# Altium project PROC114E3_SCH.PrjPcb (part 1 of 22)
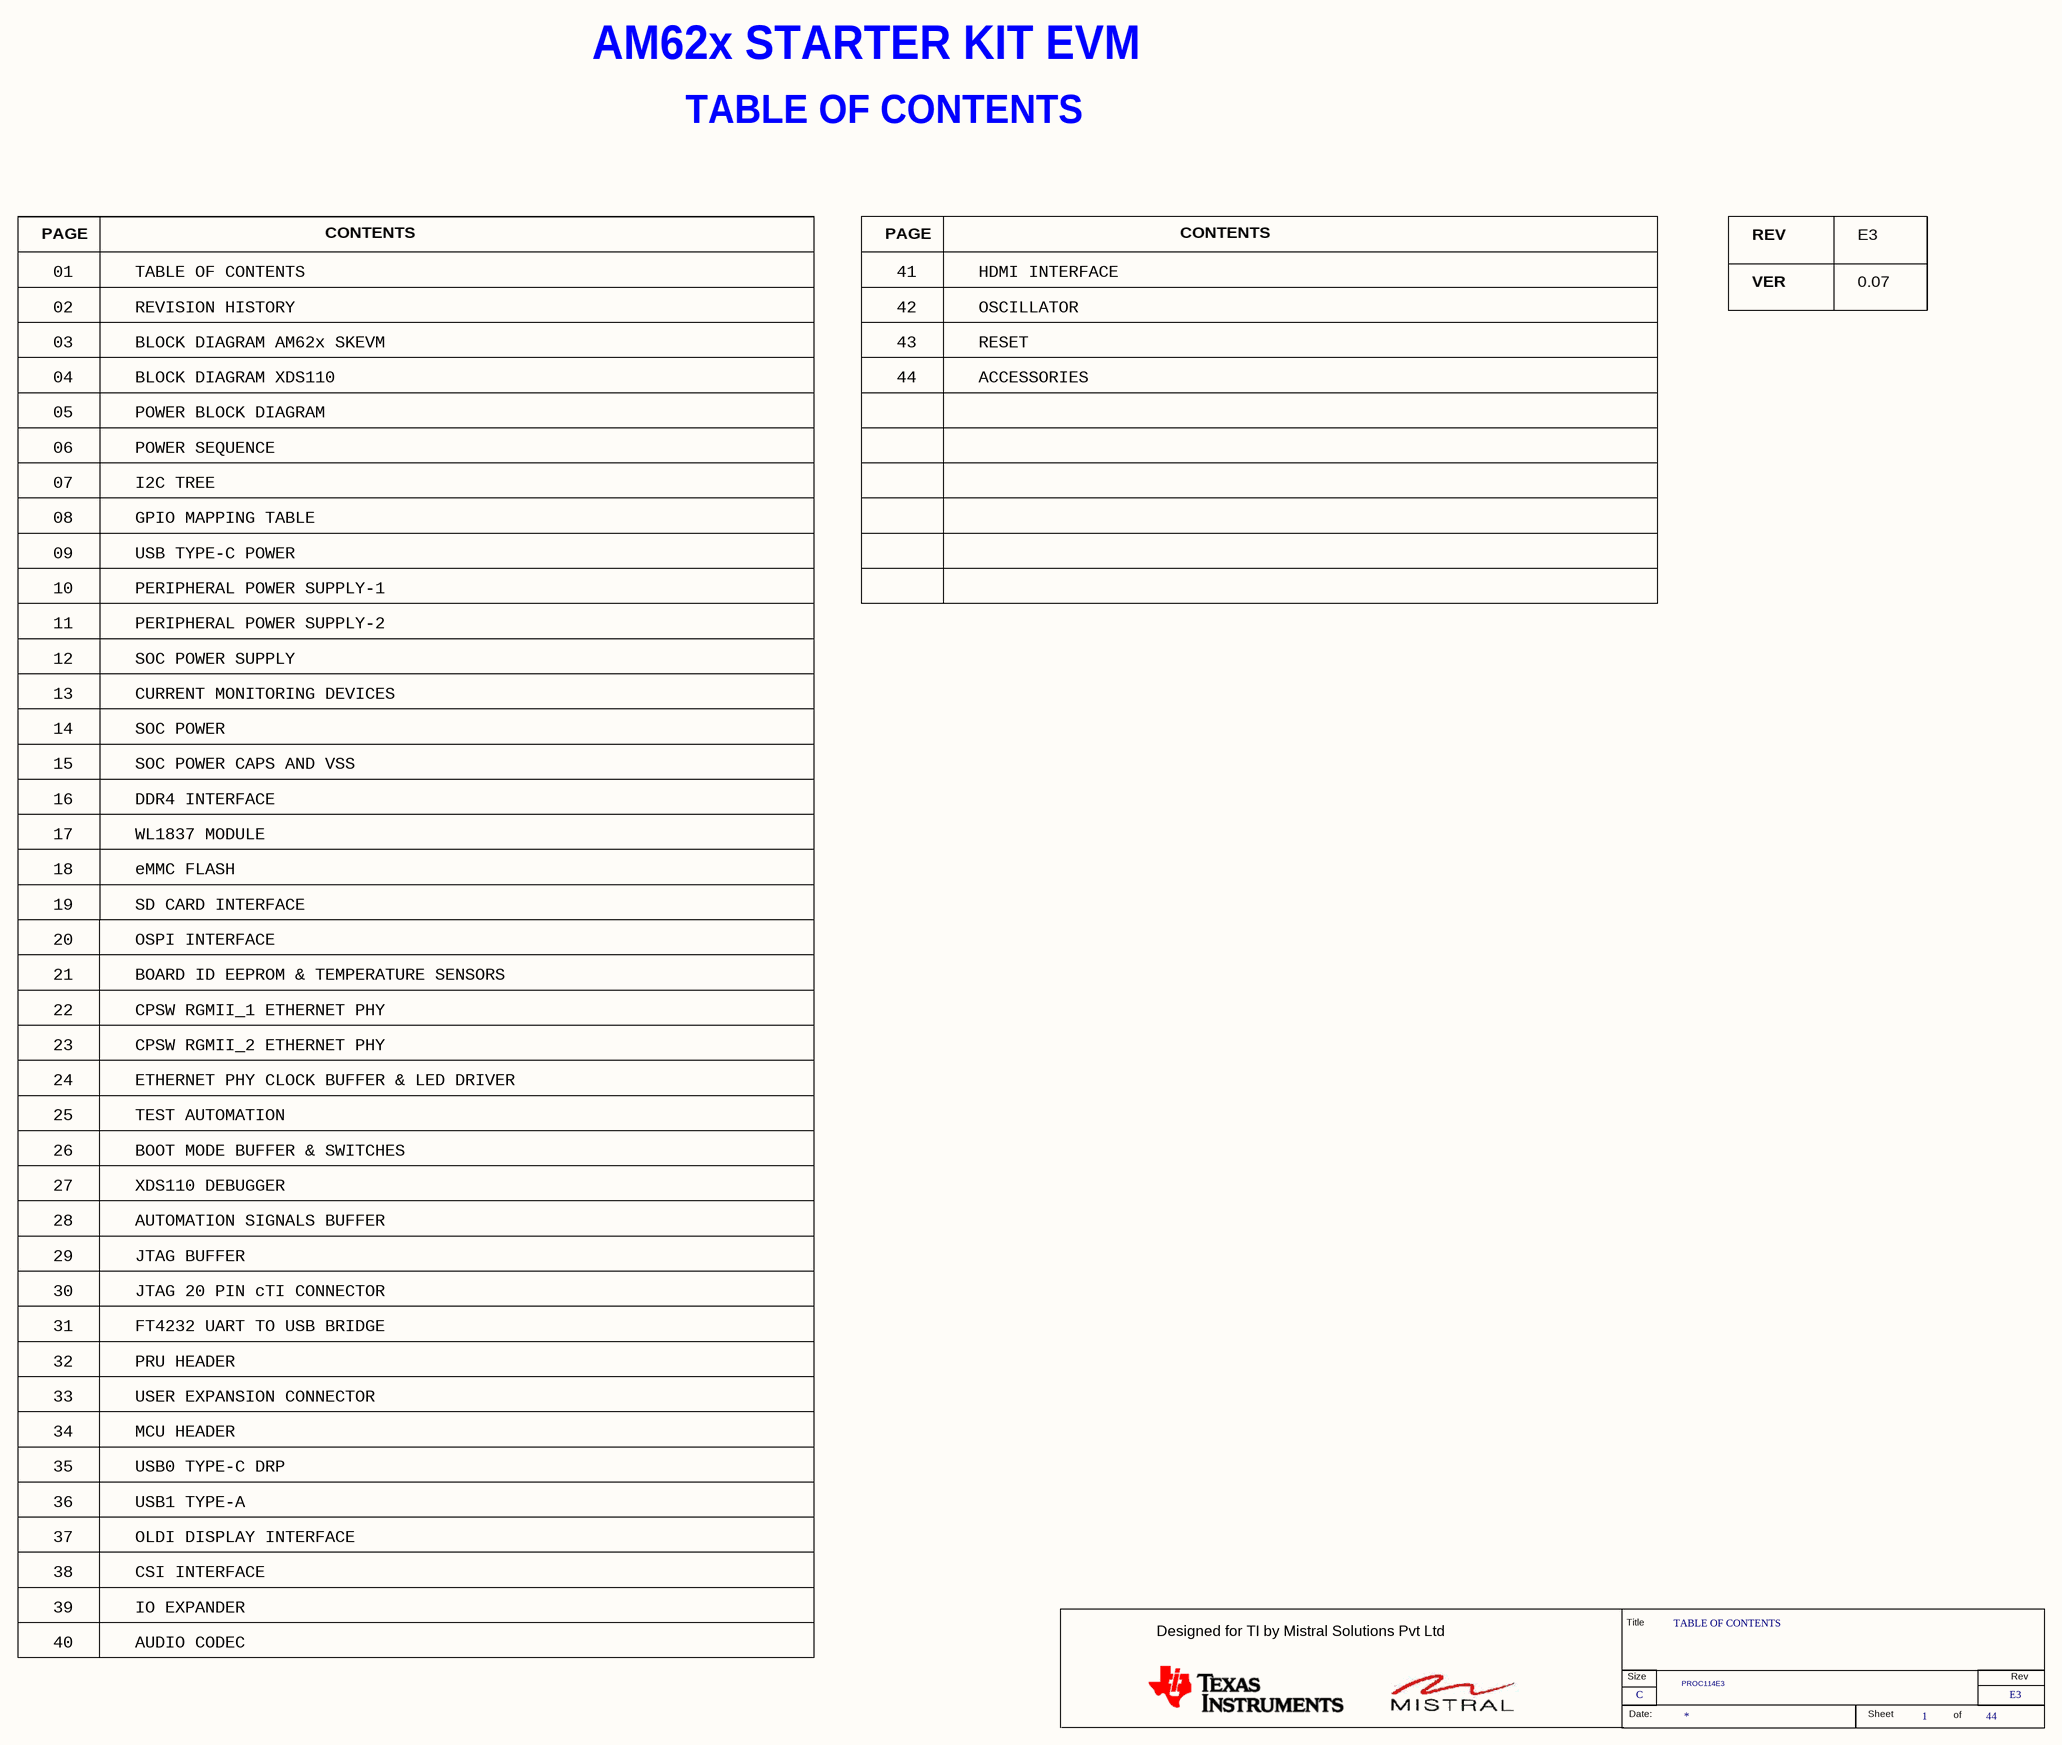
[diagram p0: 01.SchDoc]
44 sheets, 1446 parts. Net scope: global (net labels, ports and power ports of the same name join across sheets).
Board file: PROC114E3_BRD.PcbDoc
Sheets:
  01.SchDoc
  02.SchDoc
  03.SchDoc
  04.SchDoc
  05.SchDoc
  06.SchDoc
  07.SchDoc
  08.SchDoc
  09.SchDoc
  10.SchDoc
  11.SchDoc
  12.SchDoc
  13.SchDoc
  14.SchDoc
  15.SchDoc
  16.SchDoc
  17.SchDoc
  18.SchDoc
  19.SchDoc
  20.SchDoc
  21.SchDoc
  22.SchDoc
  23.SchDoc
  24.SchDoc
  25.SchDoc
  26.SchDoc
  27.SchDoc
  28.SchDoc
  29.SchDoc
  30.SchDoc
  31.SchDoc
  32.SchDoc
  33.SchDoc
  34.SchDoc
  35.SchDoc
  36.SchDoc
  37.SchDoc
  38.SchDoc
  39.SchDoc
  40.SchDoc
  41.SchDoc
  42.SchDoc
  43.SchDoc
  44.SchDoc

## Sheet 01.SchDoc
size 513 x 386 mm

### Parts
(Parts that share a designator on the sheet are numbered #1, #2 ... from top to bottom, then left to right.)
*#1  RevCode: E3  Title: TABLE OF CONTENTS  Page Size: C  Page Number: 1  Page Count: 44  Variant Name: PROC114E3  (hidden comment: MISTRAL_TITLEBLK_CSIZE)  (graphical)

### Notes on the sheet
- AM62x STARTER KIT EVM
- TABLE OF CONTENTS
- PAGE
- CONTENTS
- REV
- E3
- 01
- 41
- HDMI INTERFACE
- VER
- 0.07
- 02
- 03
- REVISION HISTORY
- BLOCK DIAGRAM AM62x SKEVM
- 42
- 43
- OSCILLATOR
- RESET
- 04
- BLOCK DIAGRAM XDS110
- 44
- ACCESSORIES
- 06
- 05
- POWER BLOCK DIAGRAM
- POWER SEQUENCE
- 07
- 08
- GPIO MAPPING TABLE
- I2C TREE
- 09
- USB TYPE-C POWER
- 11
- 10
- PERIPHERAL POWER SUPPLY-1
- PERIPHERAL POWER SUPPLY-2
- 12
- 13
- SOC POWER SUPPLY
- CURRENT MONITORING DEVICES
- 14
- SOC POWER
- 15
- 16
- SOC POWER CAPS AND VSS
- DDR4 INTERFACE
- 17
- 18
- eMMC FLASH
- WL1837 MODULE
- 19
- SD CARD INTERFACE
- 20
- 21
- OSPI INTERFACE
- BOARD ID EEPROM & TEMPERATURE SENSORS
- 22
- 23
- CPSW RGMII_1 ETHERNET PHY
- CPSW RGMII_2 ETHERNET PHY
- 24
- ETHERNET PHY CLOCK BUFFER & LED DRIVER
- 25
- 26
- BOOT MODE BUFFER & SWITCHES
- TEST AUTOMATION
- 27
- 28
- XDS110 DEBUGGER
- AUTOMATION SIGNALS BUFFER
- 29
- JTAG BUFFER
- 30
- 31
- JTAG 20 PIN cTI CONNECTOR
- FT4232 UART TO USB BRIDGE
- 32
- 33
- PRU HEADER
- USER EXPANSION CONNECTOR
- 34
- MCU HEADER
- 35
- 36
- USB0 TYPE-C DRP
- USB1 TYPE-A
- 37
- 38
- OLDI DISPLAY INTERFACE
- CSI INTERFACE
- 39
- IO EXPANDER
- 40
- AUDIO CODEC
- (in symbol MISTRAL_TITLEBLK_CSIZE) Title; Designed for TI by Mistral Solutions Pvt Ltd; Size; Rev; Date:; Sheet; of

### Library data of the parts
*#1 = MISTRAL_TITLEBLK_CSIZE: Issue: 1.0; Page Create Date: March  8, 1995; Page Modify Date: *; Schematic Page Count: 44; Schematic Page Number: 1

## Sheet 02.SchDoc
size 513 x 386 mm
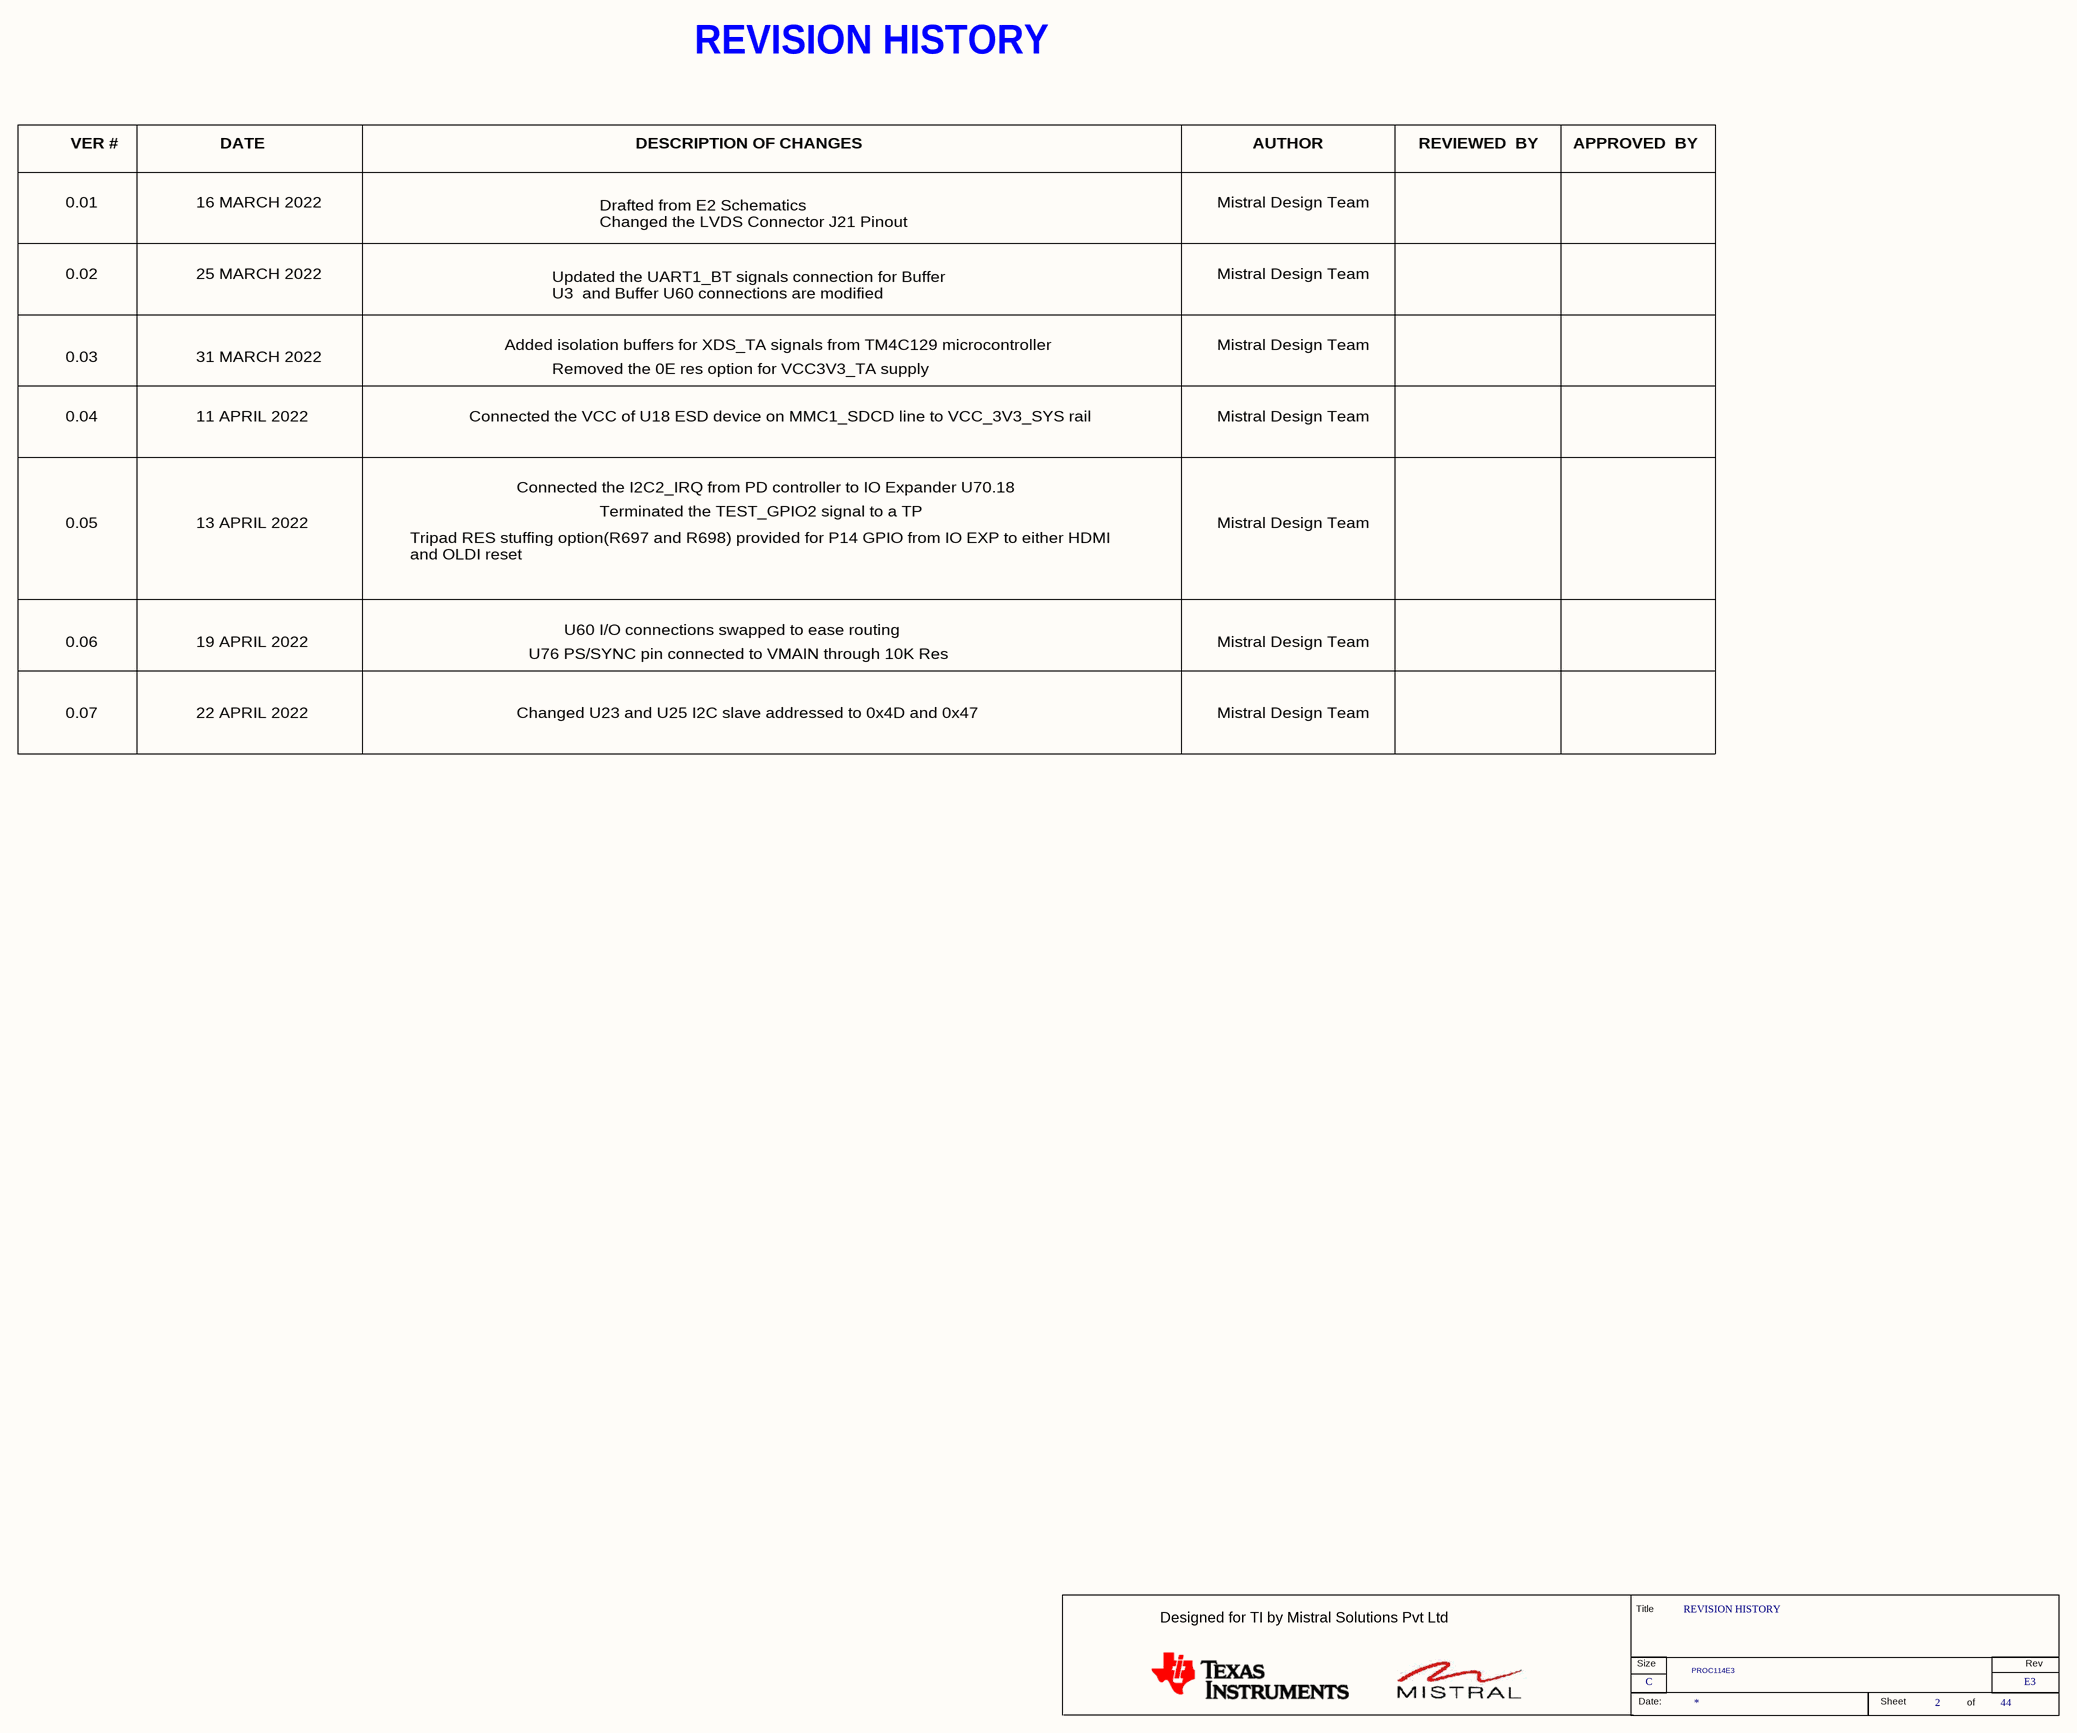
[diagram p1: 02.SchDoc]

### Parts
(Parts that share a designator on the sheet are numbered #1, #2 ... from top to bottom, then left to right.)
*#2  RevCode: E3  Title: REVISION HISTORY  Page Size: C  Page Number: 2  Page Count: 44  Variant Name: PROC114E3  (hidden comment: MISTRAL_TITLEBLK_CSIZE)  (graphical)

### Notes on the sheet
- REVISION HISTORY
- VER #
- DATE
- DESCRIPTION OF CHANGES
- AUTHOR
- REVIEWED  BY
- APPROVED  BY
- 0.01
- 16 MARCH 2022
- Drafted from E2 Schematics
  Changed the LVDS Connector J21 Pinout
- Mistral Design Team
- Updated the UART1_BT signals connection for Buffer
  U3  and Buffer U60 connections are modified
- 0.02
- 25 MARCH 2022
- 0.03
- 31 MARCH 2022
- Added isolation buffers for XDS_TA signals from TM4C129 microcontroller
- Removed the 0E res option for VCC3V3_TA supply
- 0.04
- 11 APRIL 2022
- Connected the VCC of U18 ESD device on MMC1_SDCD line to VCC_3V3_SYS rail
- Connected the I2C2_IRQ from PD controller to IO Expander U70.18
- 0.05
- 13 APRIL 2022
- Tripad RES stuffing option(R697 and R698) provided for P14 GPIO from IO EXP to either HDMI
  and OLDI reset
- Terminated the TEST_GPIO2 signal to a TP
- 0.06
- 19 APRIL 2022
- U76 PS/SYNC pin connected to VMAIN through 10K Res
- U60 I/O connections swapped to ease routing
- 0.07
- 22 APRIL 2022
- Changed U23 and U25 I2C slave addressed to 0x4D and 0x47
- (in symbol MISTRAL_TITLEBLK_CSIZE) Title; Designed for TI by Mistral Solutions Pvt Ltd; Size; Rev; Date:; Sheet; of

### Library data of the parts
*#2 = MISTRAL_TITLEBLK_CSIZE: Issue: 1.0; Page Create Date: March  8, 1995; Page Modify Date: *; Schematic Page Count: 44; Schematic Page Number: 2

## Sheet 03.SchDoc
size 513 x 386 mm
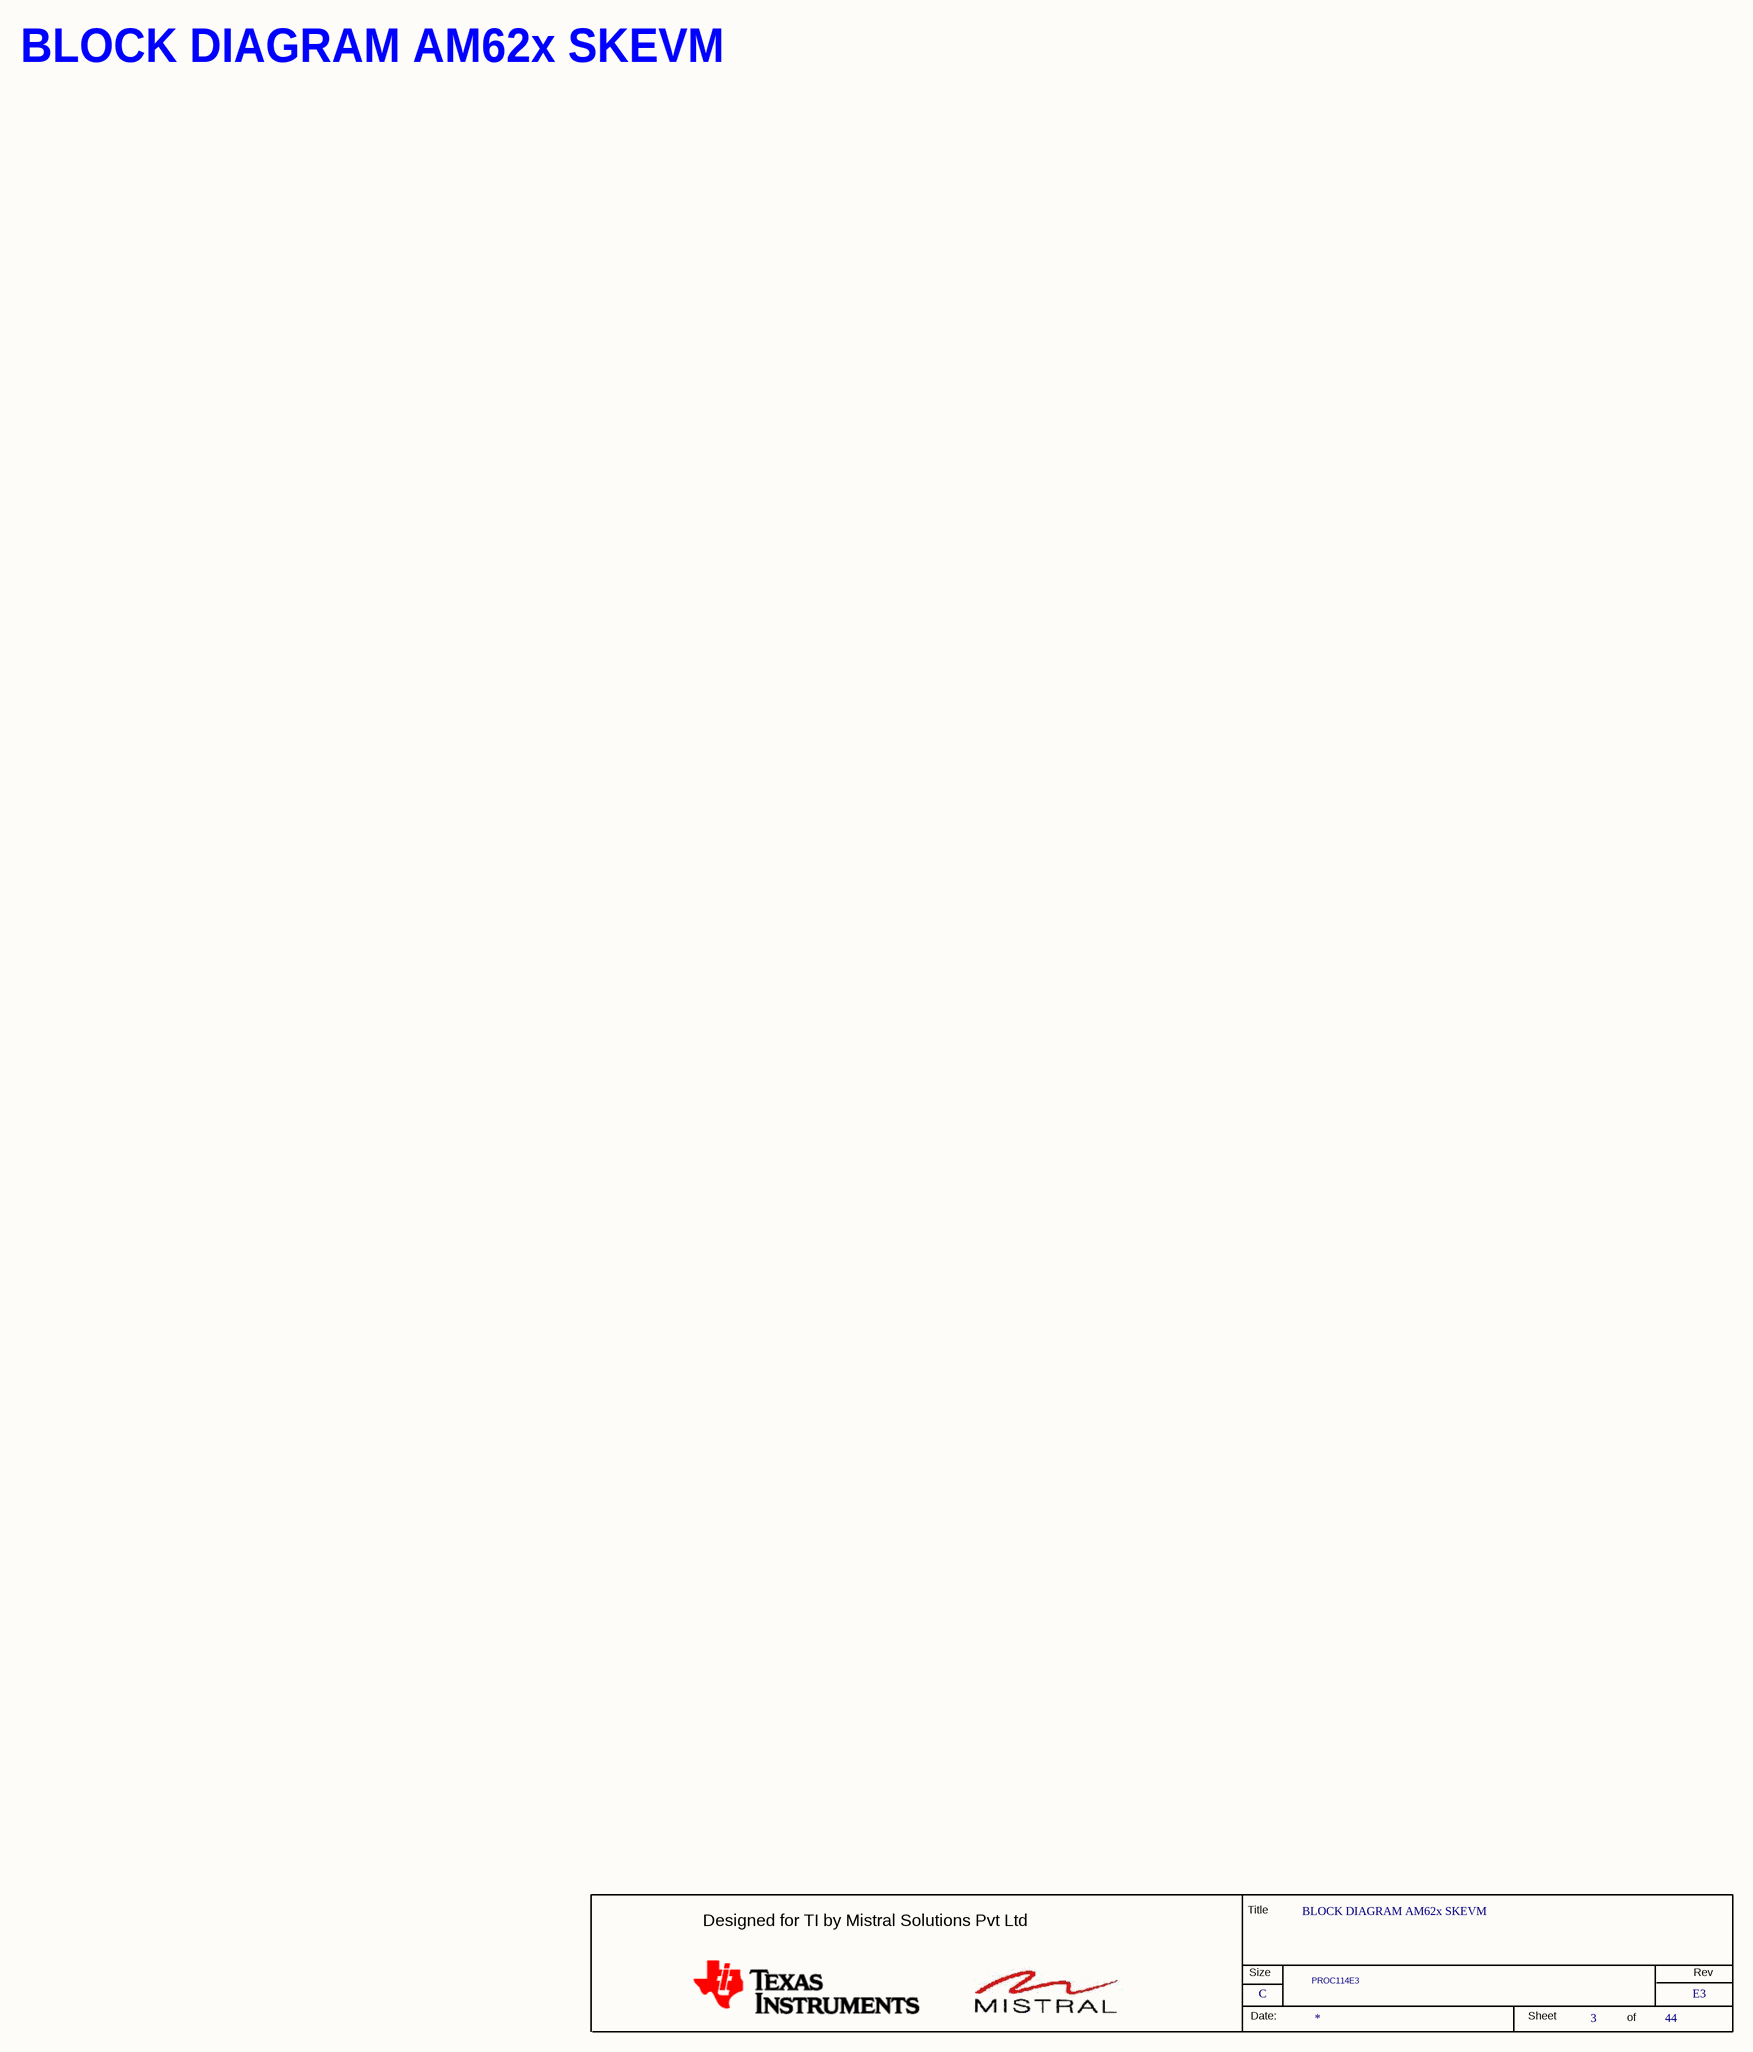
[diagram p2: 03.SchDoc]

### Parts
(Parts that share a designator on the sheet are numbered #1, #2 ... from top to bottom, then left to right.)
*#3  RevCode: E3  Title: BLOCK DIAGRAM AM62x SKEVM  Page Size: C  Page Number: 3  Page Count: 44  Variant Name: PROC114E3  (hidden comment: MISTRAL_TITLEBLK_CSIZE)  (graphical)

### Notes on the sheet
- BLOCK DIAGRAM AM62x SKEVM
- (in symbol MISTRAL_TITLEBLK_CSIZE) Title; Designed for TI by Mistral Solutions Pvt Ltd; Size; Rev; Date:; Sheet; of

### Library data of the parts
*#3 = MISTRAL_TITLEBLK_CSIZE: Issue: 1.0; Page Create Date: March  8, 1995; Page Modify Date: *; Schematic Page Count: 44; Schematic Page Number: 3

## Sheet 04.SchDoc
size 513 x 386 mm
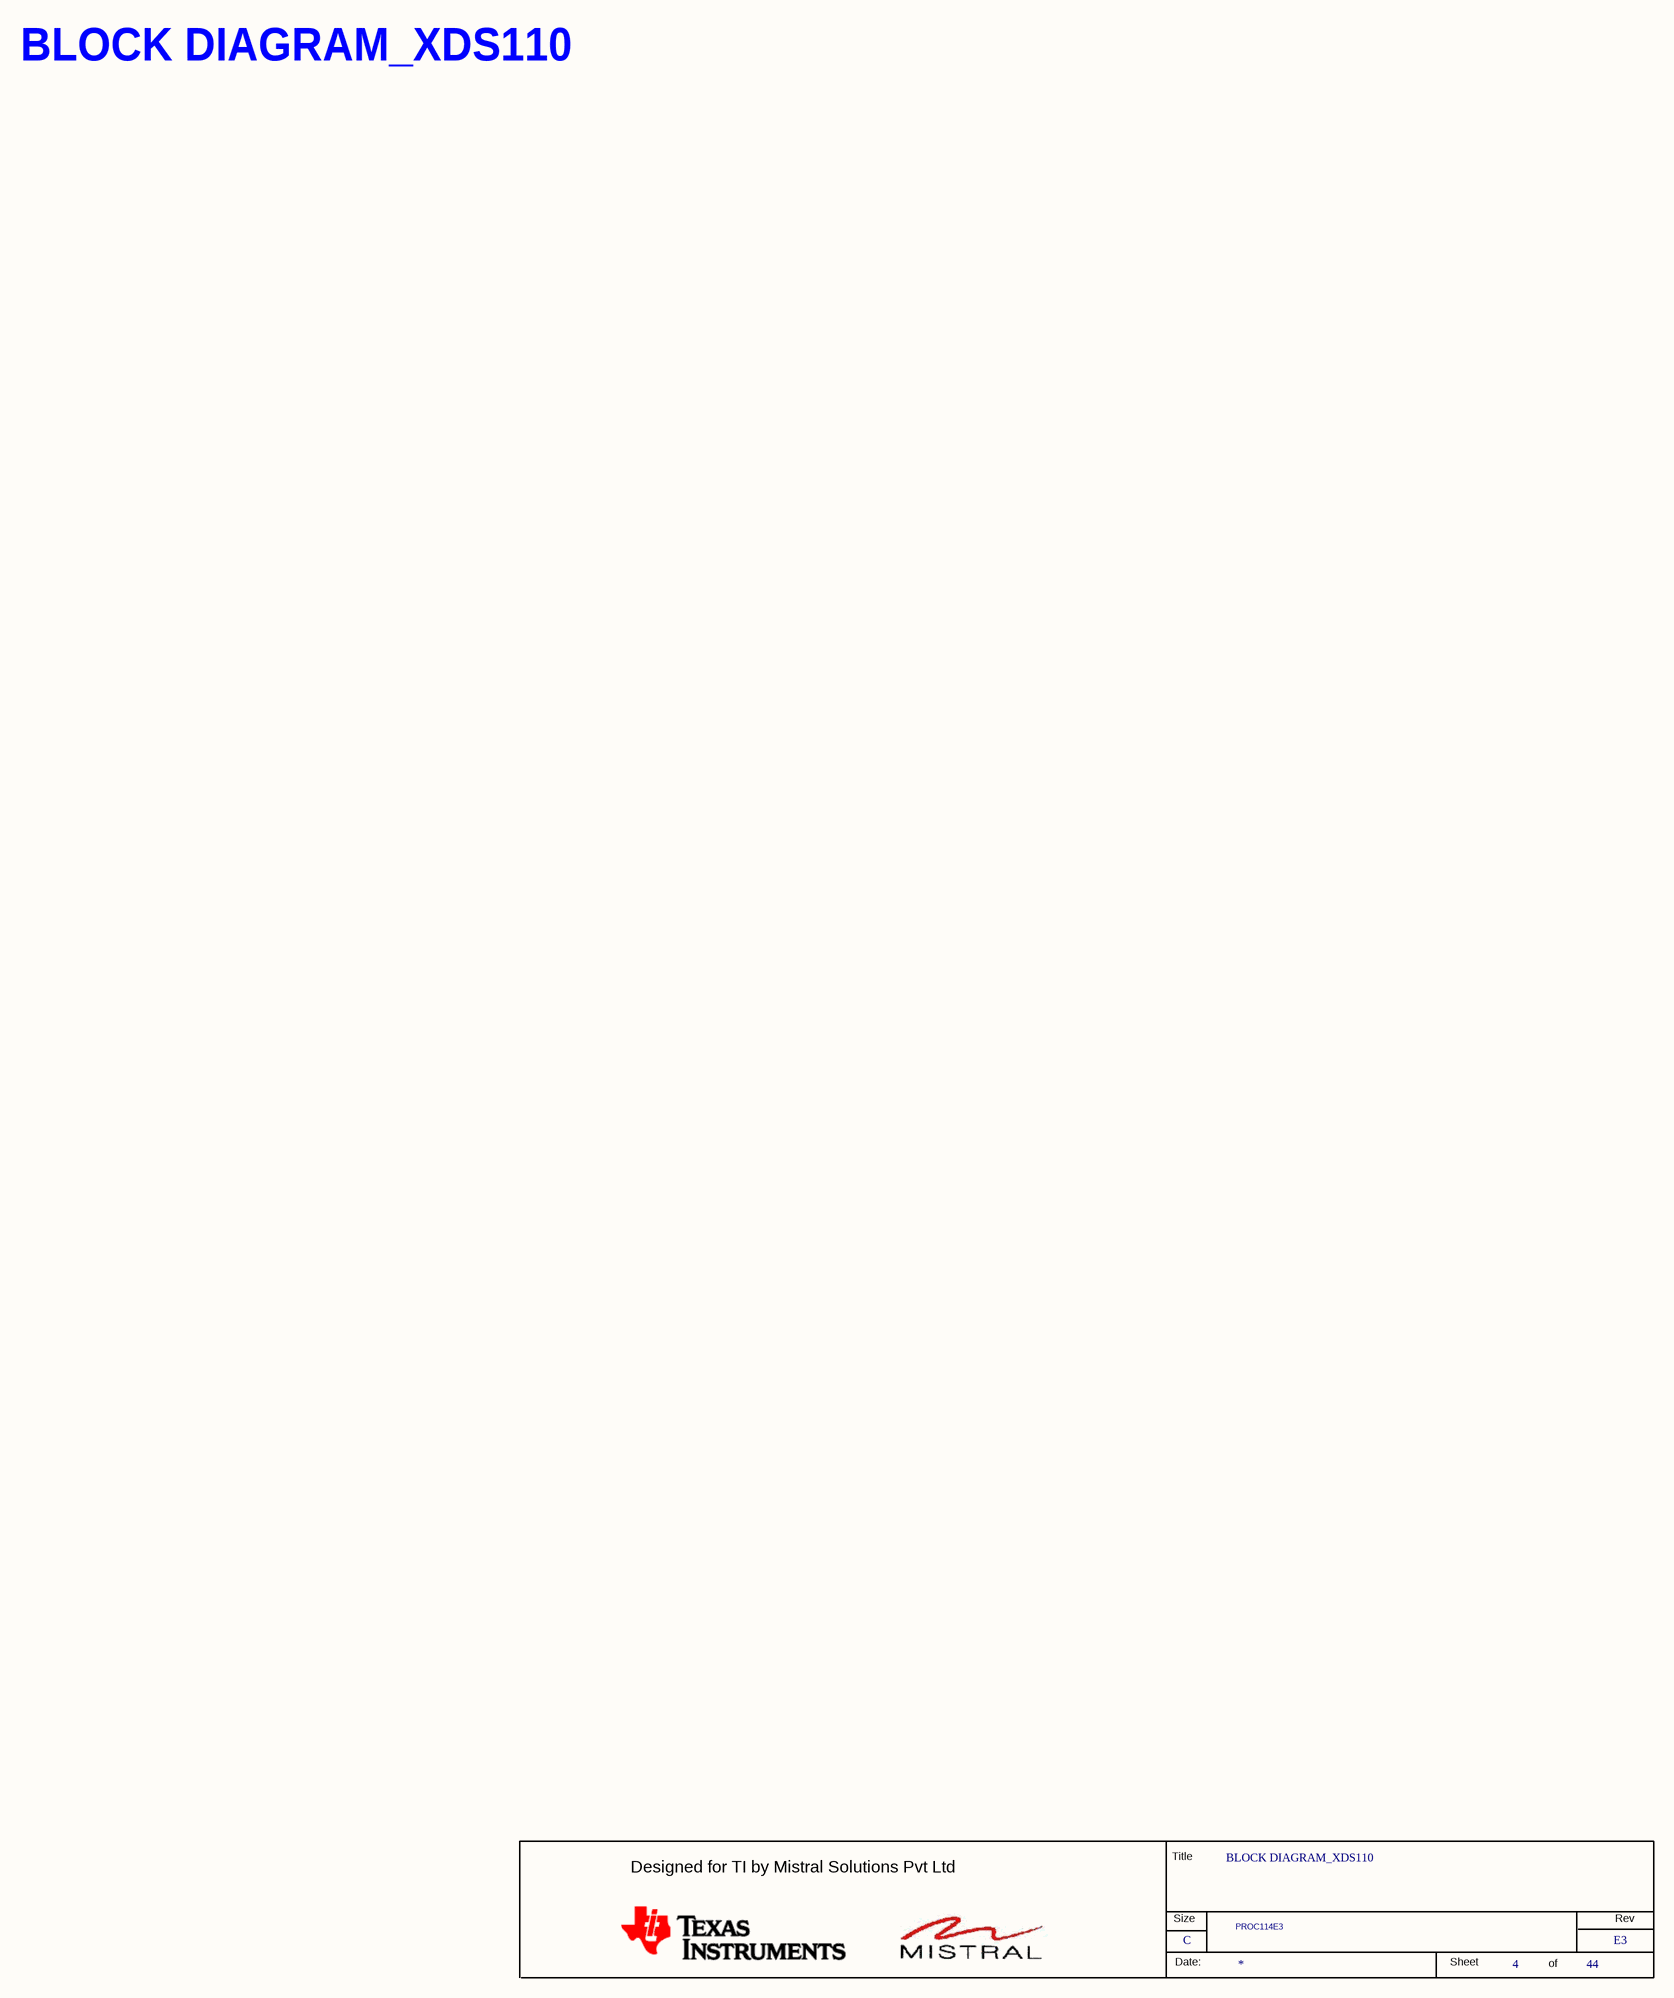
[diagram p3: 04.SchDoc]

### Parts
(Parts that share a designator on the sheet are numbered #1, #2 ... from top to bottom, then left to right.)
*#4  RevCode: E3  Title: BLOCK DIAGRAM_XDS110  Page Size: C  Page Number: 4  Page Count: 44  Variant Name: PROC114E3  (hidden comment: MISTRAL_TITLEBLK_CSIZE)  (graphical)

### Notes on the sheet
- BLOCK DIAGRAM_XDS110
- (in symbol MISTRAL_TITLEBLK_CSIZE) Title; Designed for TI by Mistral Solutions Pvt Ltd; Size; Rev; Date:; Sheet; of

### Library data of the parts
*#4 = MISTRAL_TITLEBLK_CSIZE: Issue: 1.0; Page Create Date: March  8, 1995; Page Modify Date: *; Schematic Page Count: 44; Schematic Page Number: 4

## Sheet 05.SchDoc
size 513 x 386 mm
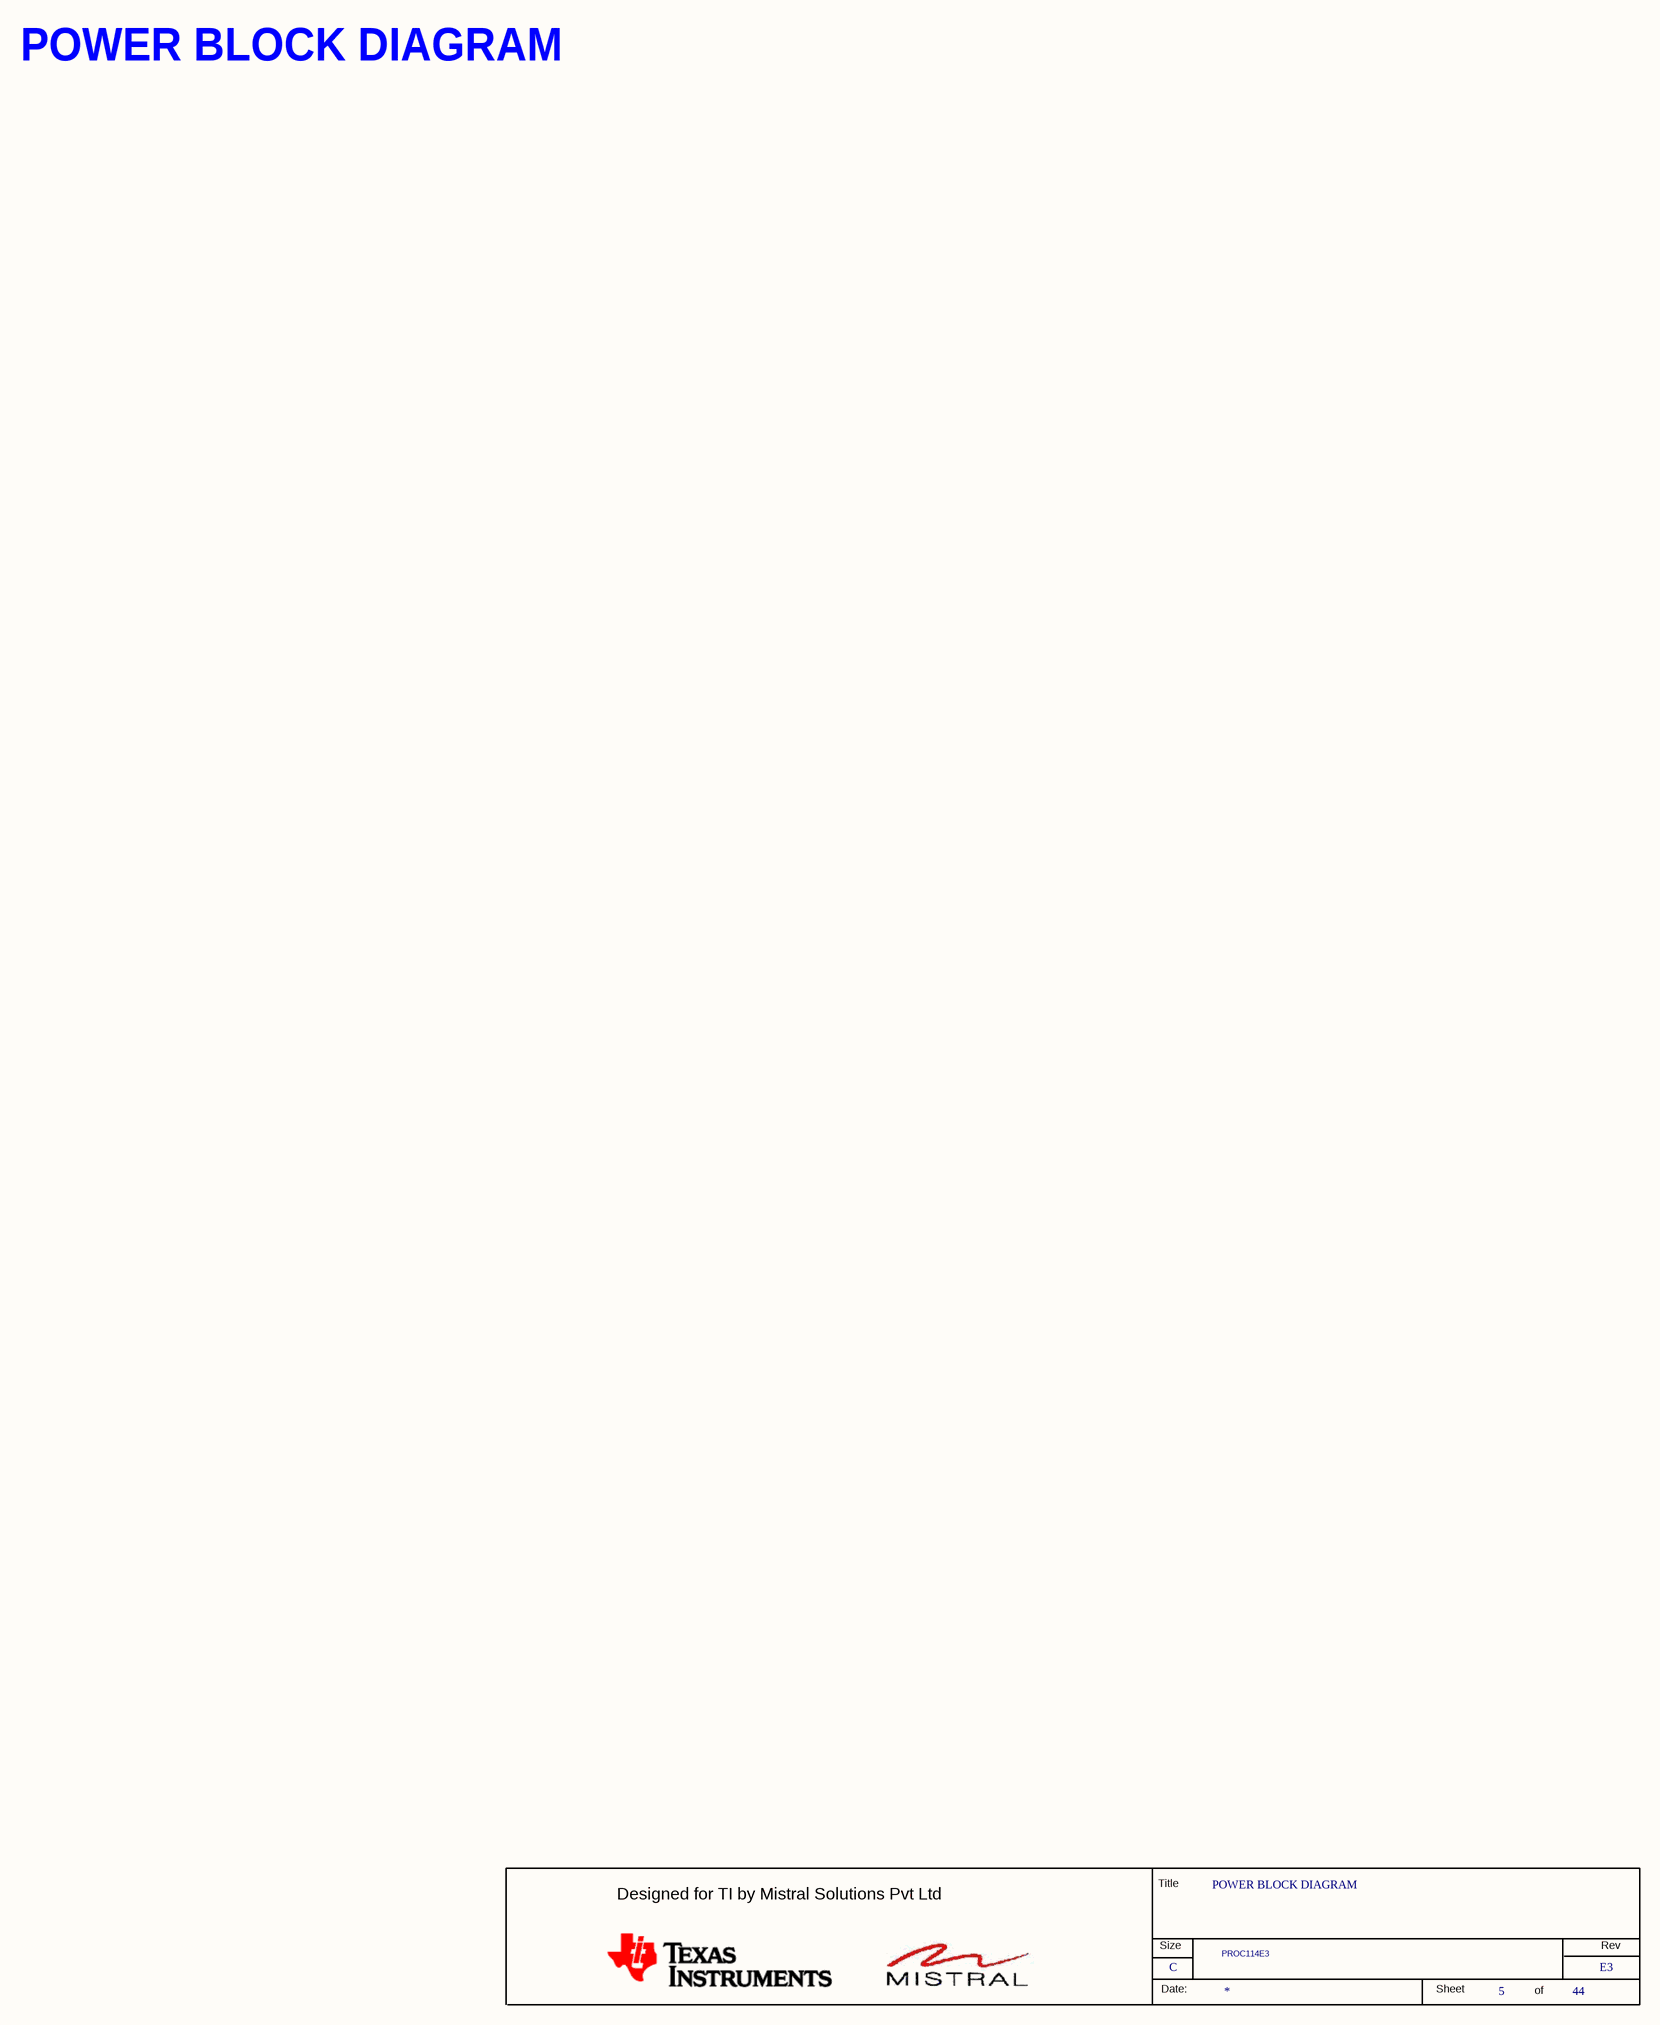
[diagram p4: 05.SchDoc]

### Parts
(Parts that share a designator on the sheet are numbered #1, #2 ... from top to bottom, then left to right.)
*#5  RevCode: E3  Title: POWER BLOCK DIAGRAM  Page Size: C  Page Number: 5  Page Count: 44  Variant Name: PROC114E3  (hidden comment: MISTRAL_TITLEBLK_CSIZE)  (graphical)

### Notes on the sheet
- POWER BLOCK DIAGRAM
- (in symbol MISTRAL_TITLEBLK_CSIZE) Title; Designed for TI by Mistral Solutions Pvt Ltd; Size; Rev; Date:; Sheet; of

### Library data of the parts
*#5 = MISTRAL_TITLEBLK_CSIZE: Issue: 1.0; Page Create Date: March  8, 1995; Page Modify Date: *; Schematic Page Count: 44; Schematic Page Number: 5

## Sheet 06.SchDoc
size 513 x 386 mm
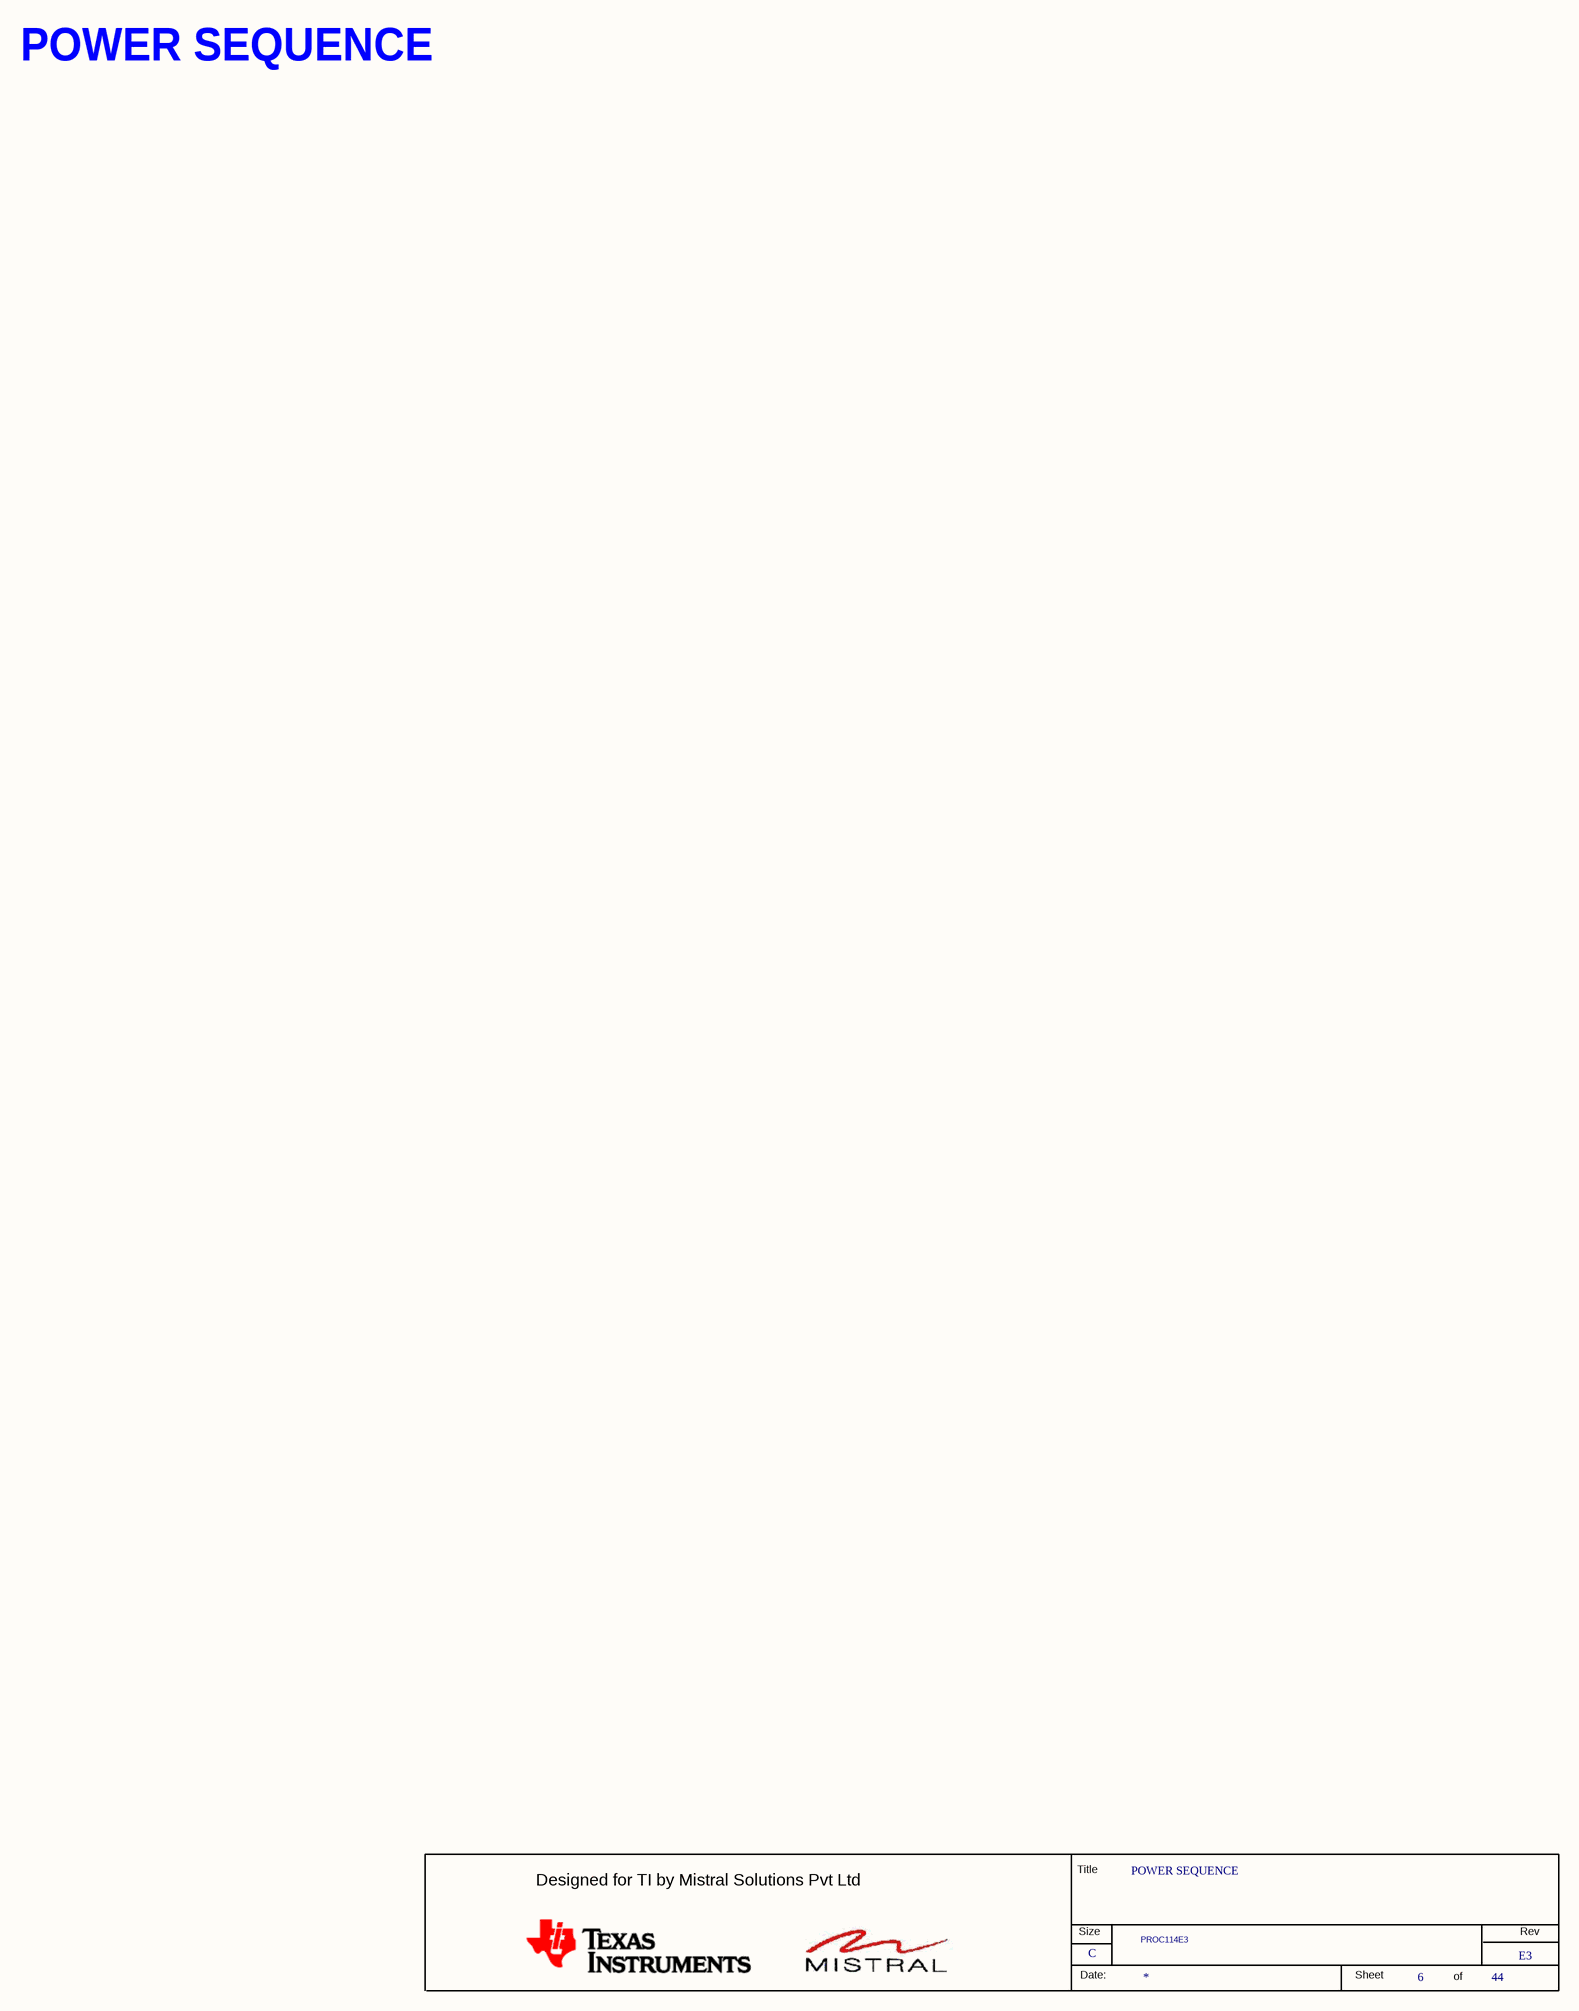
[diagram p5: 06.SchDoc]

### Parts
(Parts that share a designator on the sheet are numbered #1, #2 ... from top to bottom, then left to right.)
*#6  RevCode: E3  Title: POWER SEQUENCE  Page Size: C  Page Number: 6  Page Count: 44  Variant Name: PROC114E3  (hidden comment: MISTRAL_TITLEBLK_CSIZE)  (graphical)

### Notes on the sheet
- POWER SEQUENCE
- (in symbol MISTRAL_TITLEBLK_CSIZE) Title; Designed for TI by Mistral Solutions Pvt Ltd; Size; Rev; Date:; Sheet; of

### Library data of the parts
*#6 = MISTRAL_TITLEBLK_CSIZE: Issue: 1.0; Page Create Date: March  8, 1995; Page Modify Date: *; Schematic Page Count: 44; Schematic Page Number: 6

## Sheet 07.SchDoc
size 513 x 386 mm
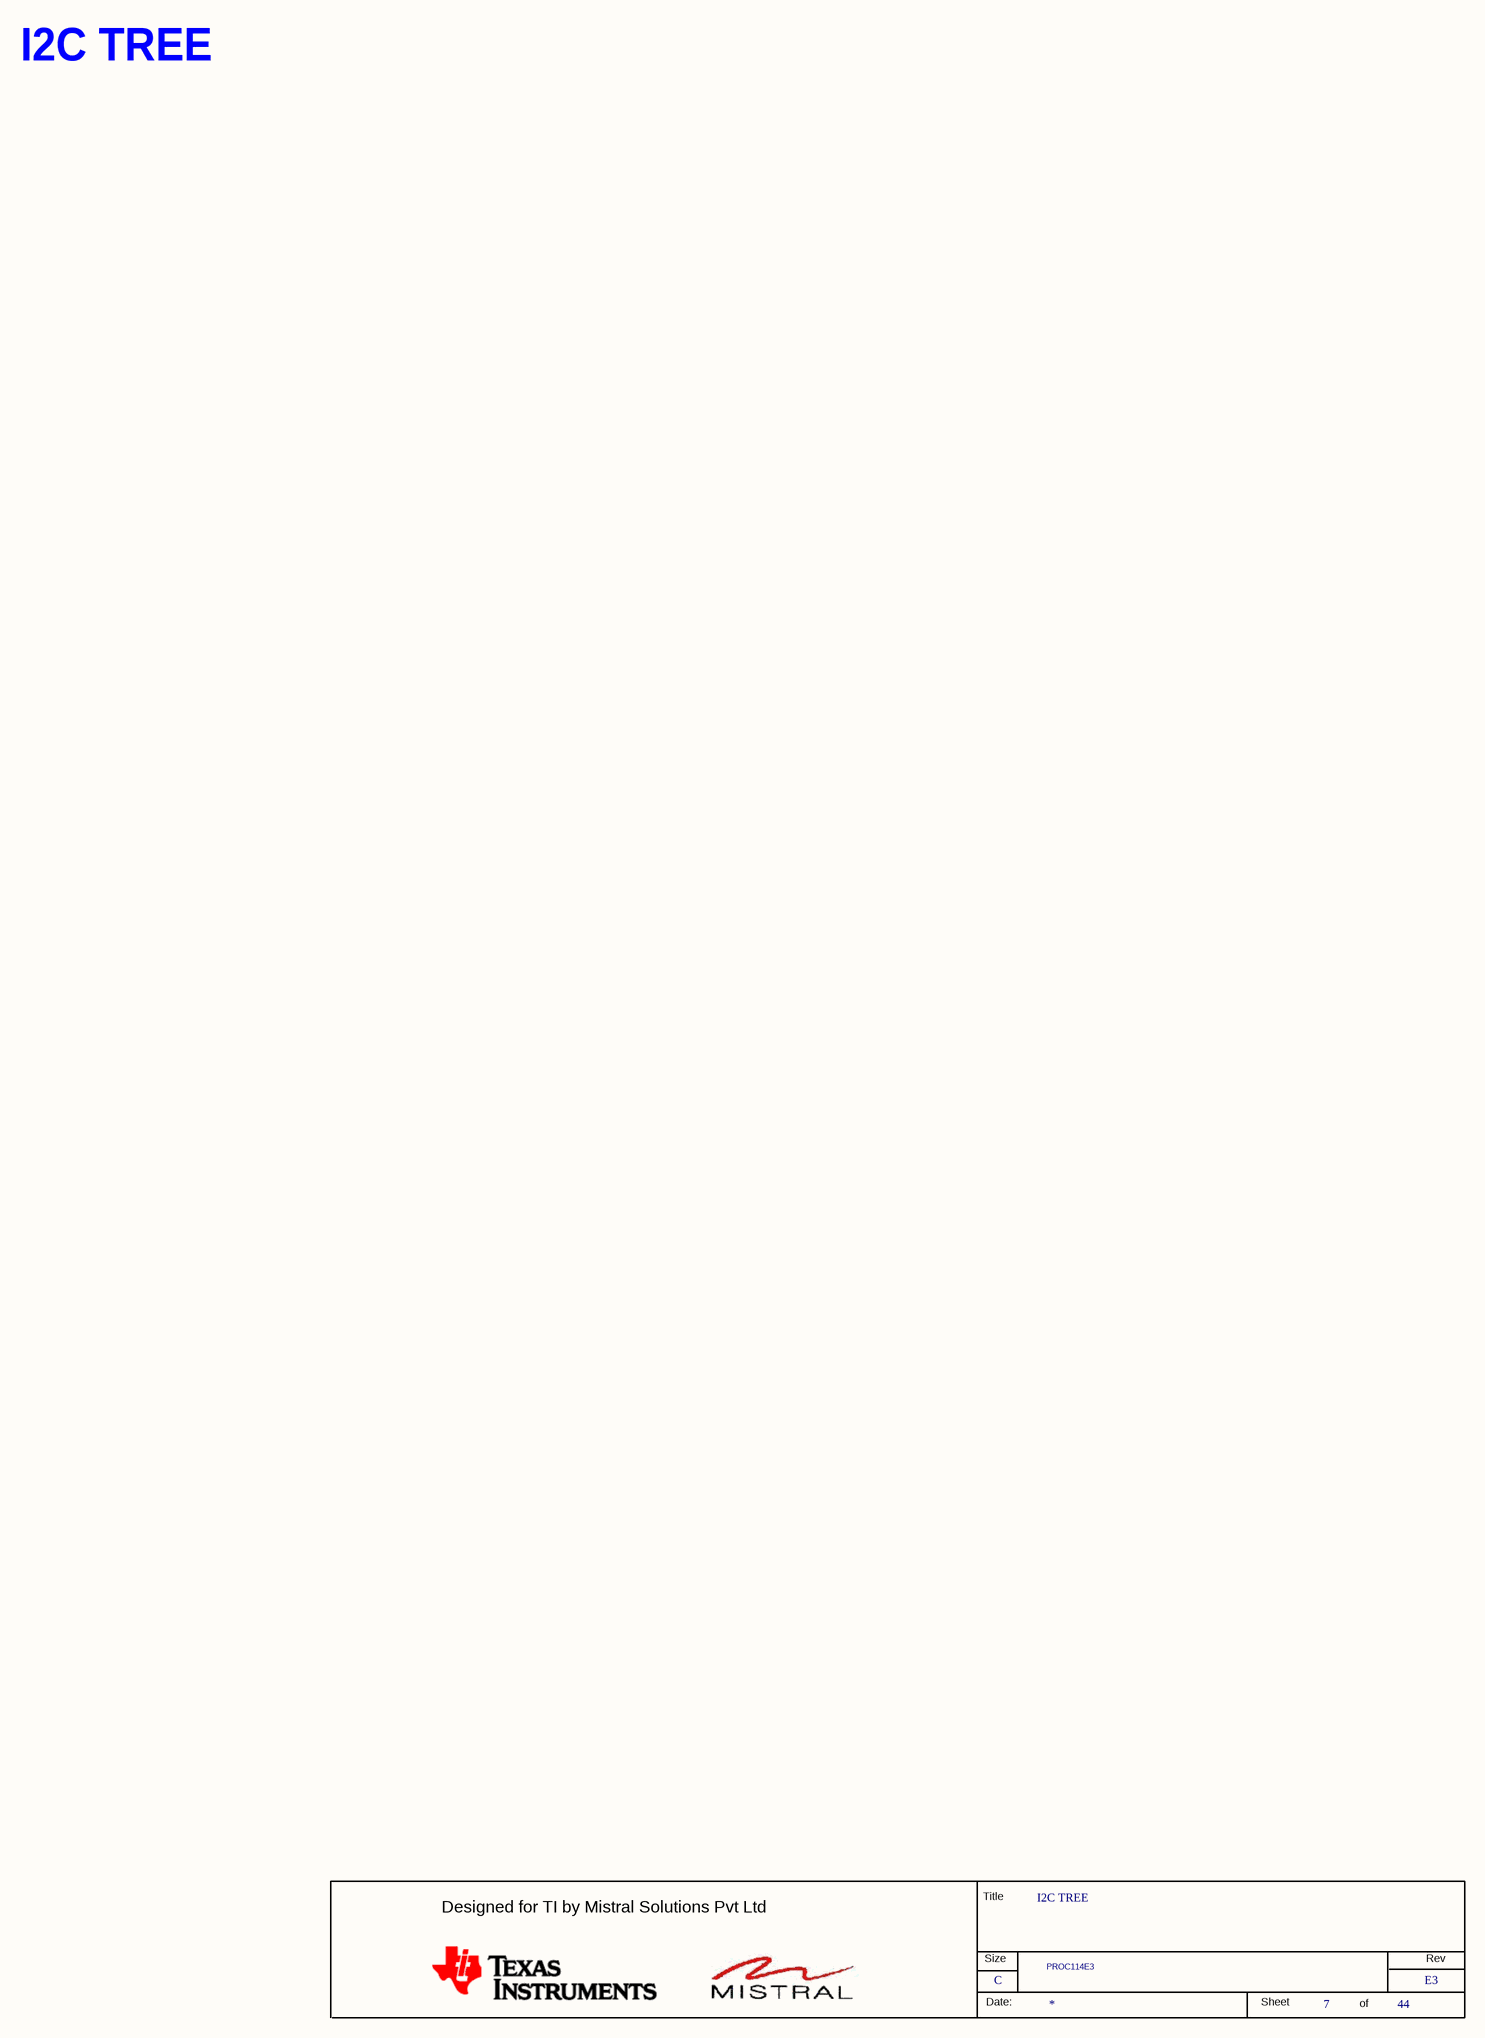
[diagram p6: 07.SchDoc]

### Parts
(Parts that share a designator on the sheet are numbered #1, #2 ... from top to bottom, then left to right.)
*#7  RevCode: E3  Title: I2C TREE  Page Size: C  Page Number: 7  Page Count: 44  Variant Name: PROC114E3  (hidden comment: MISTRAL_TITLEBLK_CSIZE)  (graphical)

### Notes on the sheet
- I2C TREE
- (in symbol MISTRAL_TITLEBLK_CSIZE) Title; Designed for TI by Mistral Solutions Pvt Ltd; Size; Rev; Date:; Sheet; of

### Library data of the parts
*#7 = MISTRAL_TITLEBLK_CSIZE: Issue: 1.0; Page Create Date: March  8, 1995; Page Modify Date: *; Schematic Page Count: 44; Schematic Page Number: 7

## Sheet 08.SchDoc
size 513 x 386 mm
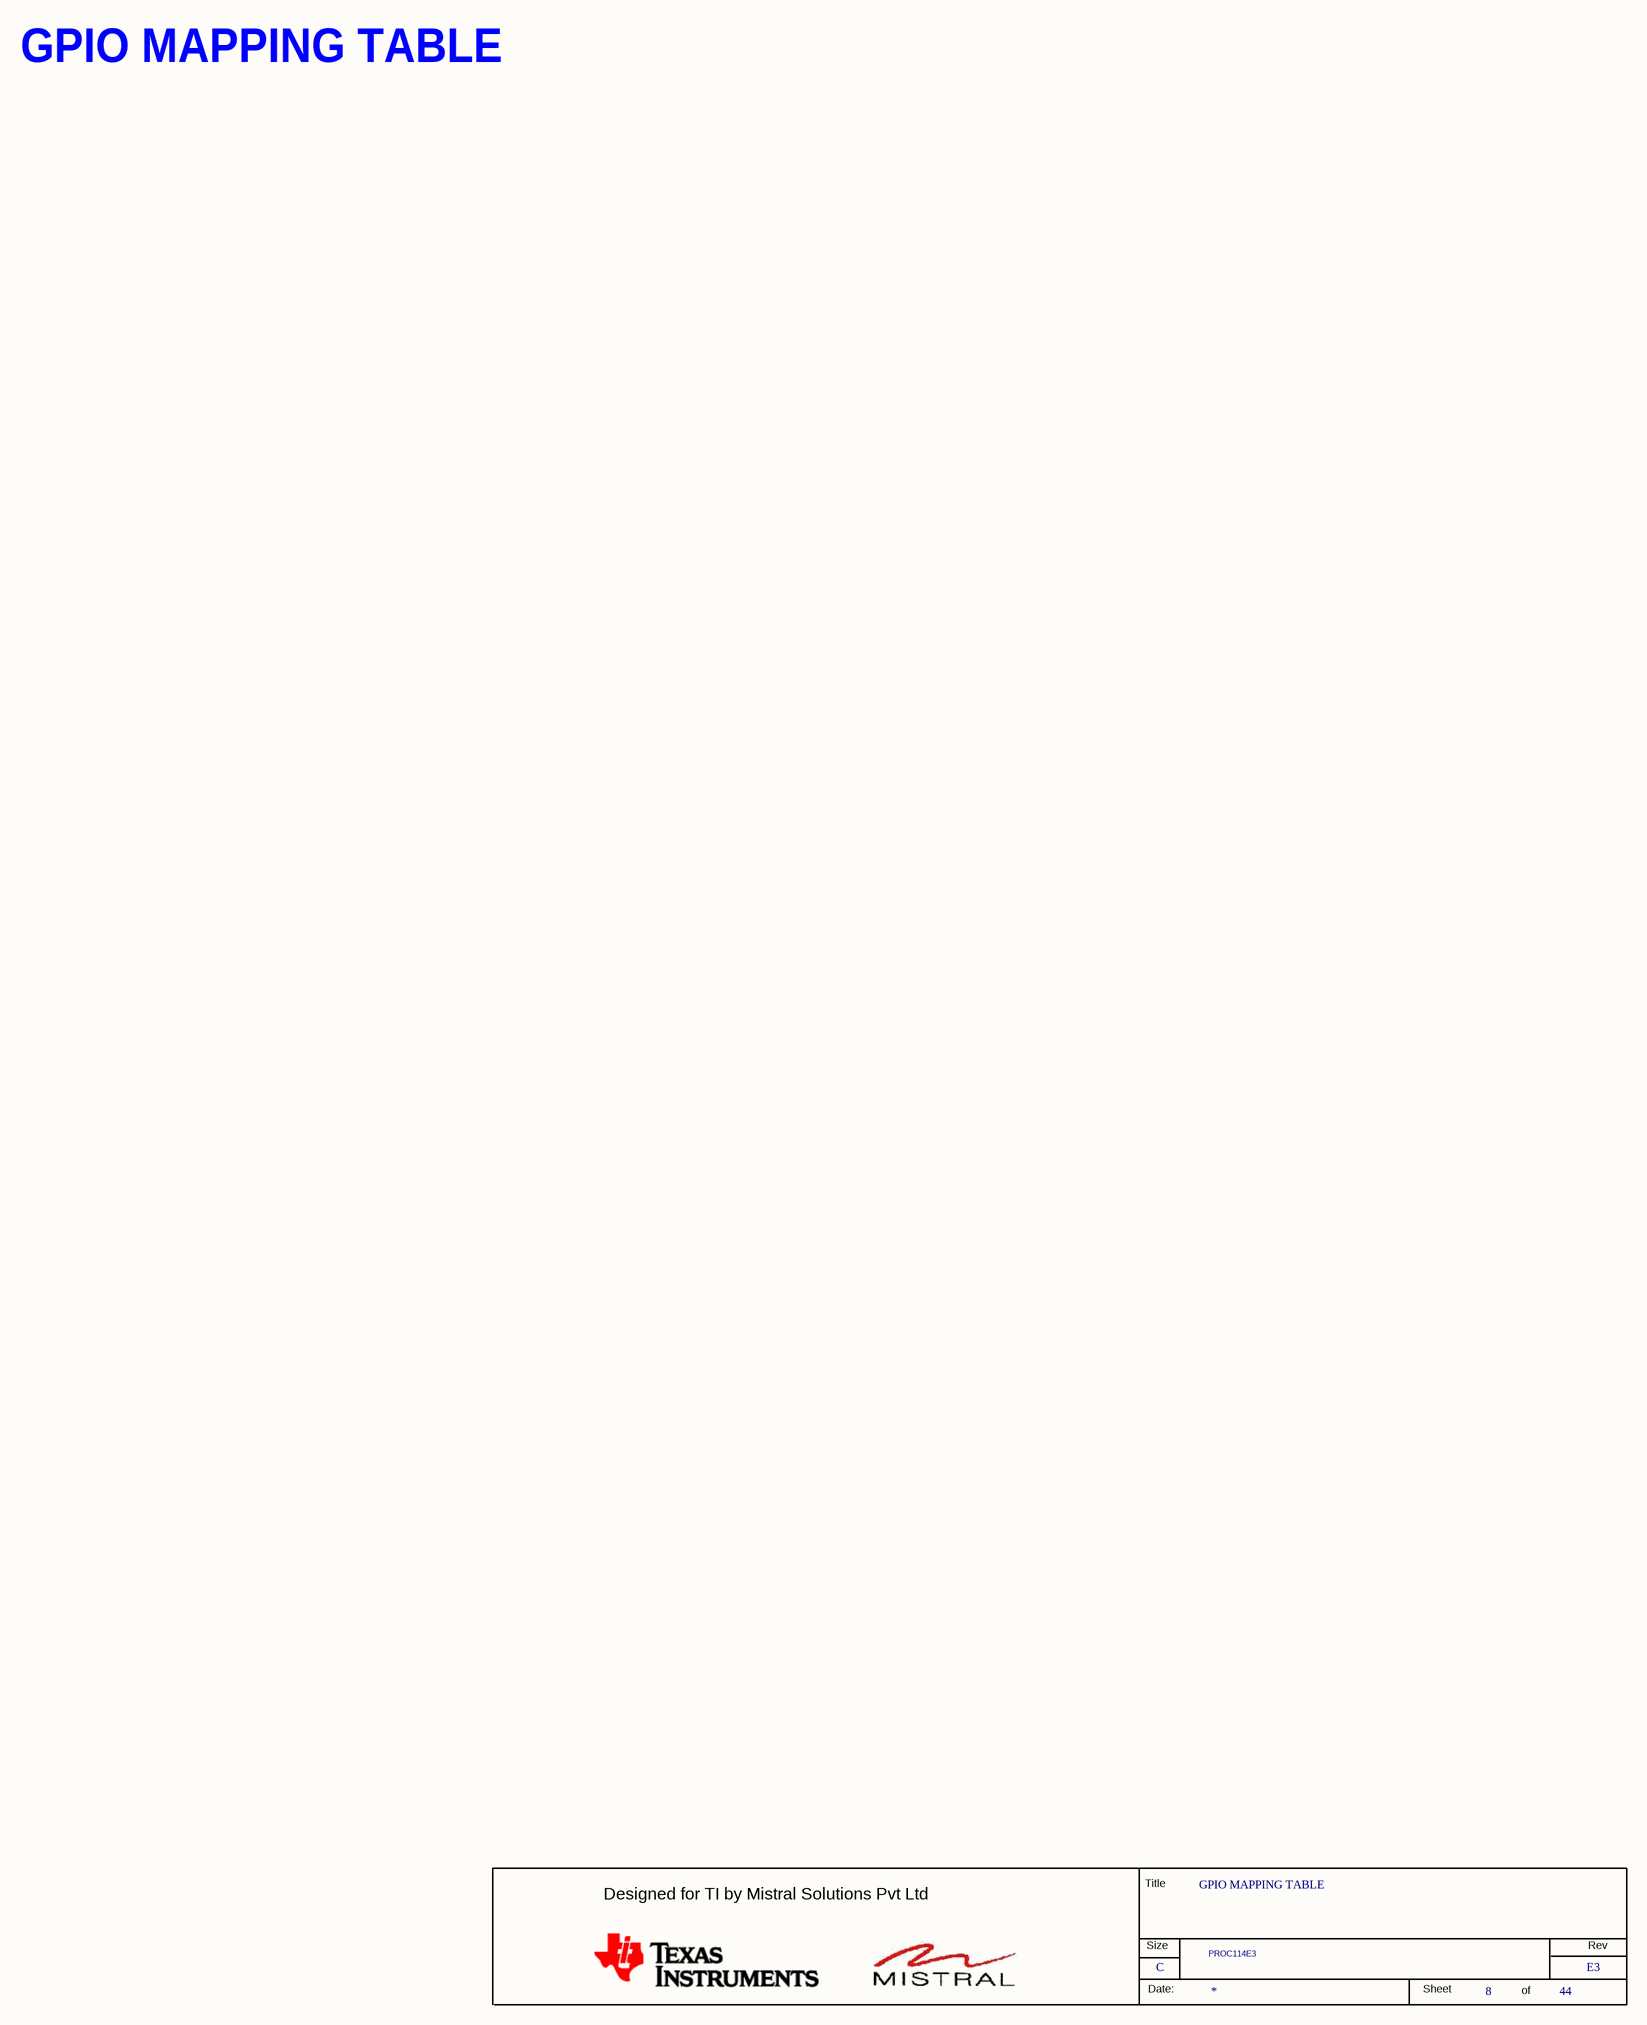
[diagram p7: 08.SchDoc]

### Parts
(Parts that share a designator on the sheet are numbered #1, #2 ... from top to bottom, then left to right.)
*#8  RevCode: E3  Title: GPIO MAPPING TABLE  Page Size: C  Page Number: 8  Page Count: 44  Variant Name: PROC114E3  (hidden comment: MISTRAL_TITLEBLK_CSIZE)  (graphical)

### Notes on the sheet
- GPIO MAPPING TABLE
- (in symbol MISTRAL_TITLEBLK_CSIZE) Title; Designed for TI by Mistral Solutions Pvt Ltd; Size; Rev; Date:; Sheet; of

### Library data of the parts
*#8 = MISTRAL_TITLEBLK_CSIZE: Issue: 1.0; Page Create Date: March  8, 1995; Page Modify Date: *; Schematic Page Count: 44; Schematic Page Number: 8

## Sheet 09.SchDoc
size 513 x 386 mm
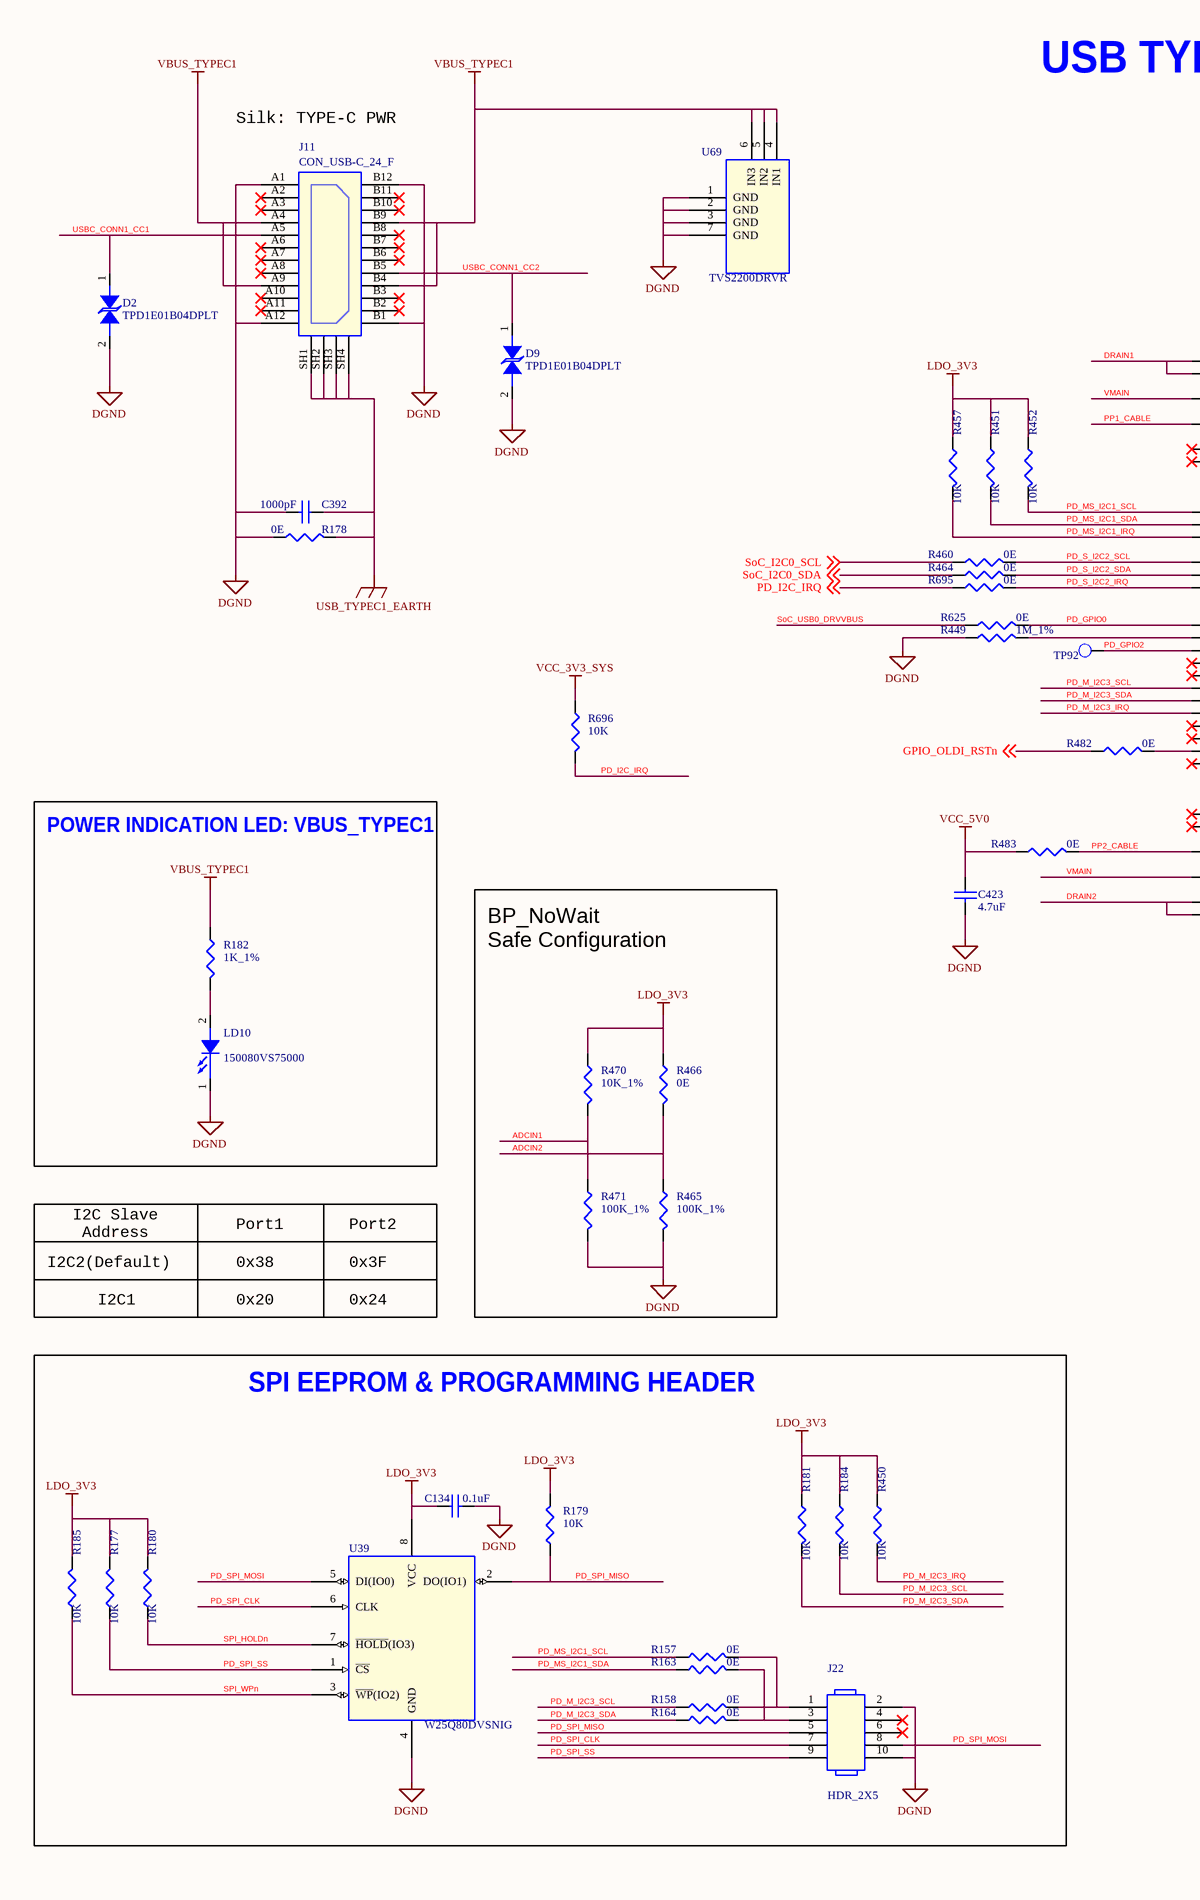
[diagram p8: 09.SchDoc, left]
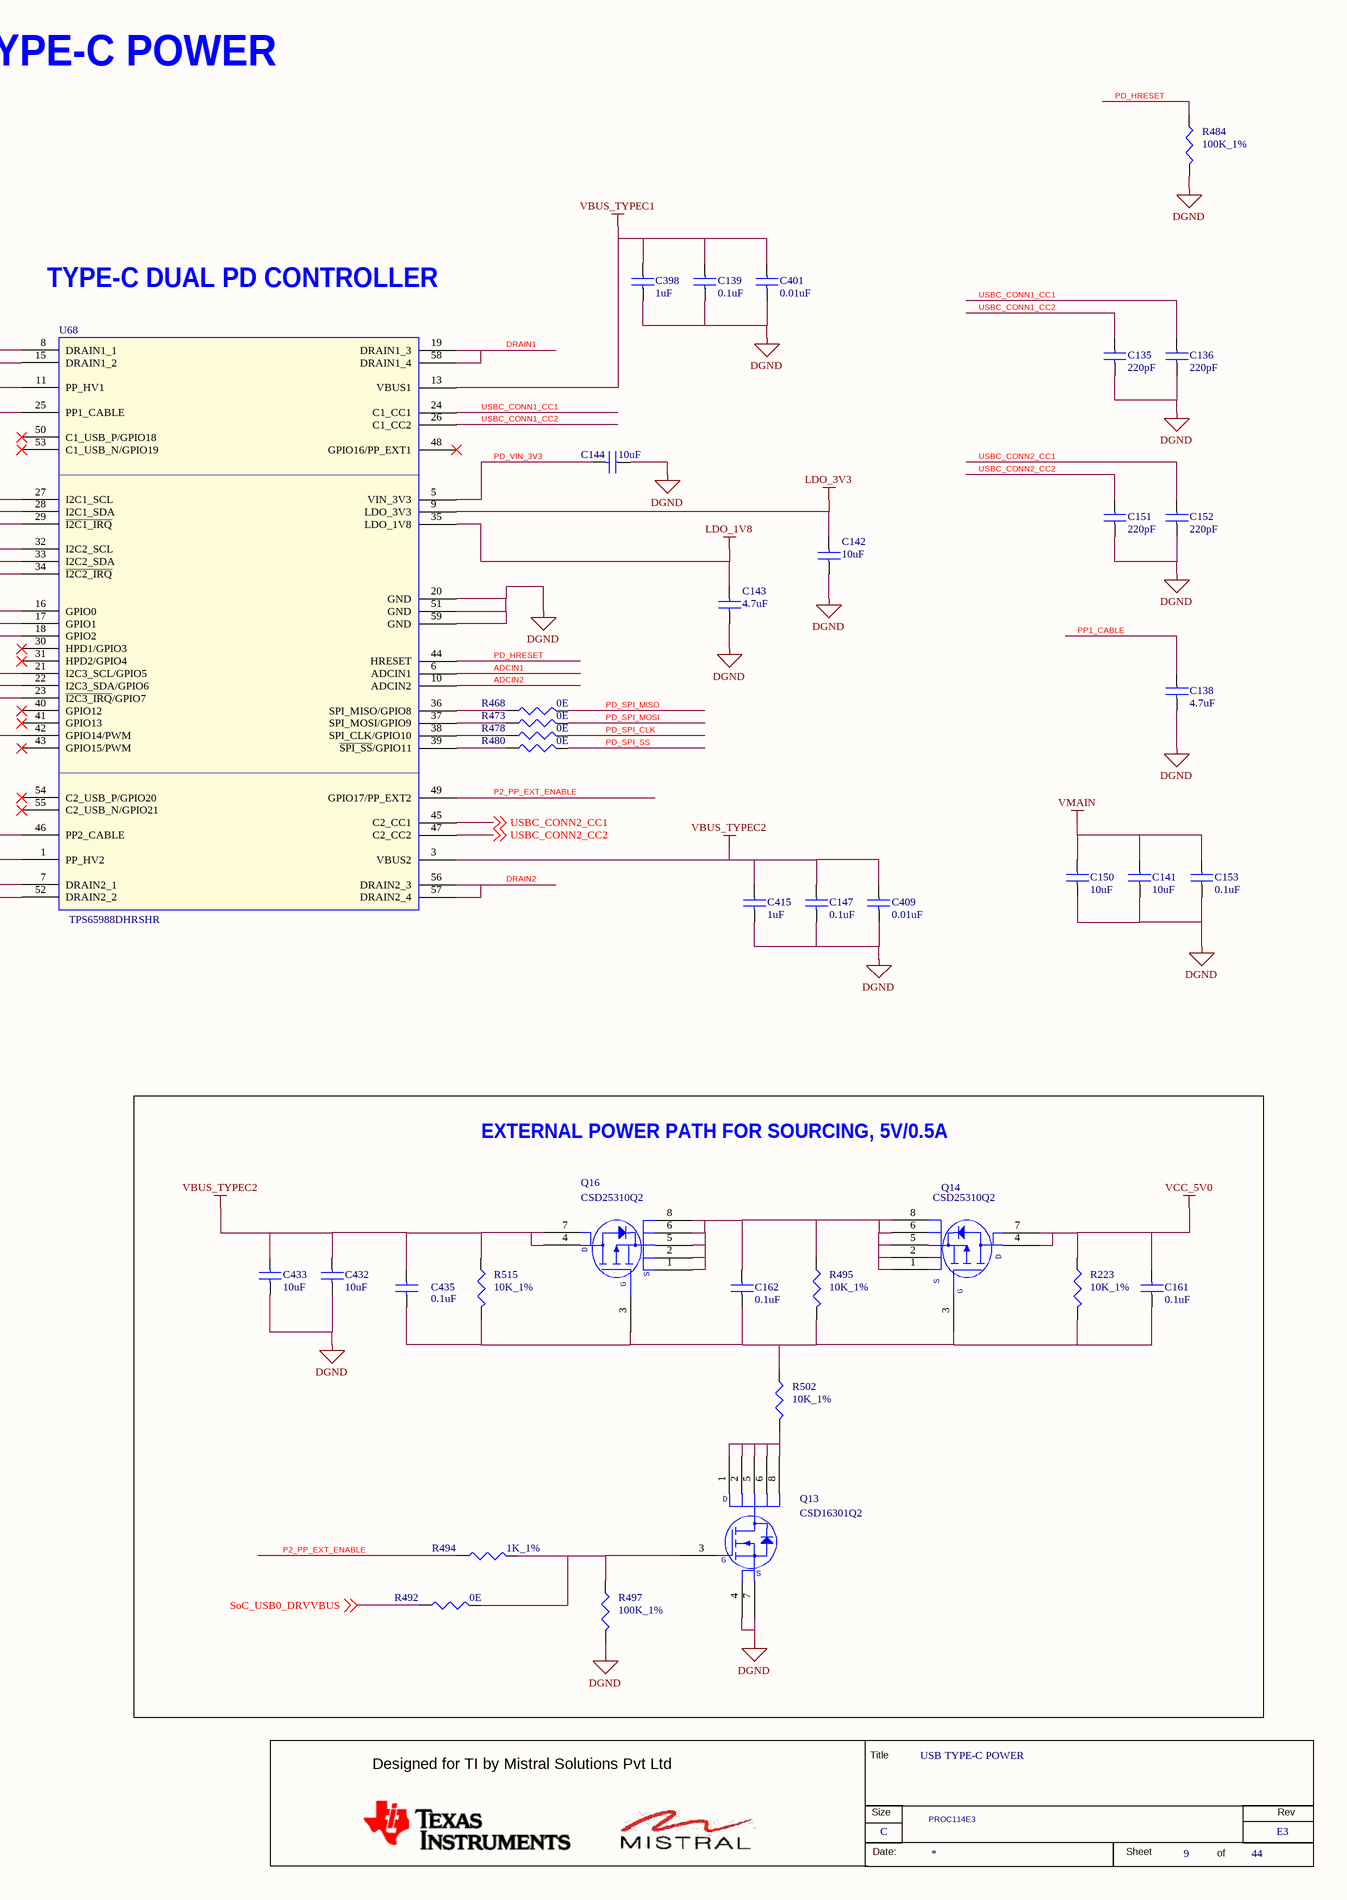
[diagram p9: 09.SchDoc, right]

### Parts
(Parts that share a designator on the sheet are numbered #1, #2 ... from top to bottom, then left to right.)
*#9  RevCode: E3  Title: USB TYPE-C POWER  Page Size: C  Page Number: 9  Page Count: 44  Variant Name: PROC114E3  (hidden comment: MISTRAL_TITLEBLK_CSIZE)  (graphical)
C134  0.1uF  [CAP0201_0-5]
C135  220pF  [CAP0402_0-75]
C136  220pF  [CAP0402_0-75]
C138  4.7uF  [CAP0402_0-75]
C139  0.1uF  [CAP0402_0-75]
C141  10uF  [CAP0603_1]
C142  10uF  [CAP0402_0-75]
C143  4.7uF  [CAP0402_0-75]
C144  10uF  [CAP0402_0-75]
C147  0.1uF  [CAP0402_0-75]
C150  10uF  [CAP0603_1]
C151  220pF  [CAP0402_0-75]
C152  220pF  [CAP0402_0-75]
C153  0.1uF  [CAP0402_0-75]
C161  0.1uF  [CAP0201_0-5]
C162  0.1uF  [CAP0201_0-5]
C392  1000pF  [CAP1206_1-75]
C398  1uF  [CAP0805_1-5]
C401  0.01uF  [CAP0201_0-5]
C409  0.01uF  [CAP0201_0-5]
C415  1uF  [CAP0805_1-5]
C423  4.7uF  [CAP0402_0-75]
C432  10uF  [CAP0603_1]
C433  10uF  [CAP0603_1]
C435  0.1uF  [CAP0201_0-5]
D2  TPD1E01B04DPLT  [DIO_DFN0201_0-4]
D9  TPD1E01B04DPLT  [DIO_DFN0201_0-4]
J11  CON_USB-C_24_F  [CON_USBC24_2012670_S_R_S_3-9]
J22  HDR_2X5  [HDR_2X5_PEC05DAAN_S_T_8-6]
LD10  150080VS75000  [LED_150080VS75000_80X50_SMD_0-8]
Q13  CSD16301Q2  [WSON6_CSD13202Q2_80X80_0-8]
Q14  CSD25310Q2  [SON6_CSD17313Q2_80X80]
Q16  CSD25310Q2  [SON6_CSD17313Q2_80X80]
R157  0E  [RES0201_0-5]
R158  0E  [RES0201_0-5]
R163  0E  [RES0201_0-5]
R164  0E  [RES0201_0-5]
R177  10K  [RES0201_0-5]
R178  0E  [RES0603_0-75]
R179  10K  [RES0201_0-5]
R180  10K  [RES0201_0-5]
R181  10K  [RES0201_0-5]
R182  1K_1%  [RES0402_0-5]
R184  10K  [RES0201_0-5]
R185  10K  [RES0201_0-5]
R223  10K_1%  [RES0201_0-5]
R449  1M_1%  [RES0402_0-5]
R450  10K  [RES0201_0-5]
R451  10K  [RES0201_0-5]
R452  10K  [RES0201_0-5]
R457  10K  [RES0201_0-5]
R460  0E  [RES0201_0-5]
R464  0E  [RES0201_0-5]
R465  100K_1%  [RES0402_0-5]
R466  0E  [RES0201_0-5]
R468  0E  [RES0201_0-5]
R470  10K_1%  [RES0201_0-5]
R471  100K_1%  [RES0402_0-5]
R473  0E  [RES0201_0-5]
R478  0E  [RES0201_0-5]
R480  0E  [RES0201_0-5]
R482  0E  [RES0201_0-5]
R483  0E  [RES0402_0-5]
R484  100K_1%  [RES0201_0-5]
R492  0E  [RES0201_0-5]
R494  1K_1%  [RES0402_0-5]
R495  10K_1%  [RES0201_0-5]
R497  100K_1%  [RES0402_0-5]
R502  10K_1%  [RES0201_0-5]
R515  10K_1%  [RES0201_0-5]
R625  0E  [RES0201_0-5]
R695  0E  [RES0201_0-5]
R696  10K  [RES0201_0-5]
TP92  TP20_SMD  [TP20_SMD]  (value not drawn)
U39  W25Q80DVSNIG  [SOIC8_1-8]
U68  TPS65988DHRSHR  [VQFN56_TPS65987D_280X280_1]
U69  TVS2200DRVR  [SON6_25-59_85X85_0-8]

### Blocks framed on the sheet
POWER INDICATION LED: VBUS_TYPEC1: LD10 R182
EXTERNAL POWER PATH FOR SOURCING, 5V/0.5A: C161 C162 C432 C433 C435 Q13 Q14 Q16 R223 R492 R494 R495 R497 R502 R515
SPI EEPROM & PROGRAMMING HEADER: C134 J22 R157 R158 R163 R164 R177 R179-R181 R184 R185 R450 U39

### Nets
DGND: C134.2 C135.2 C136.2 C138.2 C139.2 C141.2 C142.1 C143.2 C144.1 C147.2 C150.2 C151.2 C152.2 C153.2 C392.2 C398.2 C401.2 C409.2 C415.2 C423.2 C432.2 C433.2 D2.2(ANODE) D9.2(ANODE) J11.A1(GND) J11.A12(GND) J11.B1(GND) J11.B12(GND) J22.2 J22.10 LD10.1(CATHODE) Q13.4(S1) Q13.7(S2) R178.2 R449.1 R465.2 R471.2 R484.2 R497.2 U39.4(GND) U68.20(GND) U68.51(GND) U68.59(GND) U69.1(GND) U69.2(GND) U69.3(GND) U69.7(GND)
LDO_1V8: C143.1 U68.35(LDO_1V8)
LDO_3V3: C134.1 C142.2 R177.1 R179.1 R180.1 R181.1 R184.1 R185.1 R450.1 R451.1 R452.1 R457.1 R466.1 R470.1 U39.8(VCC) U68.9(LDO_3V3)
USB_TYPEC1_EARTH: C392.1 J11.SH1 J11.SH2 J11.SH3 J11.SH4 R178.1
VBUS_TYPEC1: C139.1 C398.1 C401.1 J11.A4(VBUS1) J11.A9(VBUS2) J11.B4(VBUS3) J11.B9(VBUS4) R182.1 U68.13(VBUS1) U69.4(IN1) U69.5(IN2) U69.6(IN3)
VBUS_TYPEC2: C147.1 C409.1 C415.1 C432.1 C433.1 C435.1 Q16.4(D1) Q16.7(D2) R515.1 U68.3(VBUS2)
VCC_3V3_SYS: R696.1
VCC_5V0: C161.1 C423.1 Q14.4(D1) Q14.7(D2) R223.1 R483.1
VMAIN: C141.1 C150.1 C153.1 U68.1(PP_HV2) U68.11(PP_HV1)
ADCIN1: R470.2 R471.1 U68.6(ADCIN1)
ADCIN2: R465.1 R466.2 U68.10(ADCIN2)
DRAIN1: U68.8(DRAIN1_1) U68.15(DRAIN1_2) U68.19(DRAIN1_3) U68.58(DRAIN1_4)
DRAIN2: U68.7(DRAIN2_1) U68.52(DRAIN2_2) U68.56(DRAIN2_3) U68.57(DRAIN2_4)
GPIO_OLDI_RSTn: R482.1 ; off-sheet GPIO_OLDI_RSTn
P2_PP_EXT_ENABLE: R494.1 U68.49(GPIO17/PP_EXT2)
PD_GPIO0: R625.2 U68.16(GPIO0)
PD_GPIO2: TP92.1(TP) U68.18(GPIO2)
PD_HRESET: R484.1 U68.44(HRESET)
PD_I2C_IRQ: R695.1 R696.2 ; off-sheet PD_I2C_IRQ
PD_M_I2C3_IRQ: R450.2 U68.23(~{I2C3_IRQ}/GPIO7)
PD_M_I2C3_SCL: R158.1 R184.2 U68.21(I2C3_SCL/GPIO5)
PD_M_I2C3_SDA: R164.1 R181.2 U68.22(I2C3_SDA/GPIO6)
PD_MS_I2C1_IRQ: R457.2 U68.29(~{I2C1_IRQ})
PD_MS_I2C1_SCL: R157.1 R452.2 U68.27(I2C1_SCL)
PD_MS_I2C1_SDA: R163.1 R451.2 U68.28(I2C1_SDA)
PD_S_I2C2_IRQ: R695.2 U68.34(~{I2C2_IRQ})
PD_S_I2C2_SCL: R460.2 U68.32(I2C2_SCL)
PD_S_I2C2_SDA: R464.2 U68.33(I2C2_SDA)
PD_SPI_CLK: J22.7 R478.2 U39.6(CLK)
PD_SPI_MISO: J22.5 R179.2 R468.2 U39.2(DO(IO1))
PD_SPI_MOSI: J22.8 R473.2 U39.5(DI(IO0))
PD_SPI_SS: J22.9 R177.2 R480.2 U39.1(~{CS})
PD_VIN_3V3: C144.2 U68.5(VIN_3V3)
PP1_CABLE: C138.1 U68.25(PP1_CABLE)
PP2_CABLE: R483.2 U68.46(PP2_CABLE)
SoC_I2C0_SCL: R460.1 ; off-sheet SoC_I2C0_SCL
SoC_I2C0_SDA: R464.1 ; off-sheet SoC_I2C0_SDA
SoC_USB0_DRVVBUS: R492.1 R625.1 ; off-sheet SoC_USB0_DRVVBUS
SPI_HOLDn: R180.2 U39.7(~{HOLD}(IO3))
SPI_WPn: R185.2 U39.3(~{WP}(IO2))
USBC_CONN1_CC1: C136.1 D2.1(CATHODE) J11.A5(CC1) U68.24(C1_CC1)
USBC_CONN1_CC2: C135.1 D9.1(CATHODE) J11.B5(CC2) U68.26(C1_CC2)
USBC_CONN2_CC1: C152.1 U68.45(C2_CC1) ; off-sheet USBC_CONN2_CC1
USBC_CONN2_CC2: C151.1 U68.47(C2_CC2) ; off-sheet USBC_CONN2_CC2
NetC161_2: C161.2 C162.2 C435.2 Q14.3(G) Q16.3(G) R223.2 R495.2 R502.1 R515.2
NetC162_1: C162.1 Q14.1(S1) Q14.2(S2) Q14.5(S3) Q14.6(S4) Q14.8(S5) Q16.1(S1) Q16.2(S2) Q16.5(S3) Q16.6(S4) Q16.8(S5) R495.1
NetJ22_1: J22.1 R157.2 R158.2
NetJ22_3: J22.3 R163.2 R164.2
NetLD10_2: LD10.2(ANODE) R182.2
NetQ13_1: Q13.1(D1) Q13.2(D2) Q13.5(D3) Q13.6(D4) Q13.8(D5) R502.2
NetQ13_3: Q13.3(G) R492.2 R494.2 R497.1
NetR449_2: R449.2 U68.17(GPIO1)
NetR468_1: R468.1 U68.36(SPI_MISO/GPIO8)
NetR473_1: R473.1 U68.37(SPI_MOSI/GPIO9)
NetR478_1: R478.1 U68.38(SPI_CLK/GPIO10)
NetR480_1: R480.1 U68.39(~{SPI_SS}/GPIO11)
NetR482_2: R482.2 U68.42(GPIO14/PWM)

Not connected (* = marked no-connect by the designer): J11 A2(TX1+)* A3(TX1-)* A6(D+_1)* A7(D-_1)* A8(SBU1)* A10(RX2-)* A11(RX2+)* B2(TX2+)* B3(TX2-)* B6(D+_2)* B7(D-_2)* B8(SBU2)* B10(RX1-)* B11(RX1+)*; J22 4* 6*; U68 30(HPD1/GPIO3)* 31(HPD2/GPIO4)* 40(GPIO12)* 41(GPIO13)* 43(GPIO15/PWM)* 48(GPIO16/PP_EXT1)* 50(C1_USB_P/GPIO18)* 53(C1_USB_N/GPIO19)* 54(C2_USB_P/GPIO20)* 55(C2_USB_N/GPIO21)*

### Notes on the sheet
- USB TYPE-C POWER
- Silk: TYPE-C PWR
- TYPE-C DUAL PD CONTROLLER
- BP_NoWait
  Safe Configuration
- I2C Slave
  Address
- Port1
- Port2
- I2C2(Default)
- I2C1
- 0x38
- 0x20
- 0x3F
- 0x24
- (in symbol MISTRAL_TITLEBLK_CSIZE) Title; Designed for TI by Mistral Solutions Pvt Ltd; Size; Rev; Date:; Sheet; of
- (in symbol MOSFET_CSD17313Q2) D; S
- (in symbol MOSFET_CSD25310Q2) D; S

### Library data of the parts
*#9 = MISTRAL_TITLEBLK_CSIZE: Issue: 1.0; Page Create Date: March  8, 1995; Page Modify Date: *
C134 C161 C162 = CAP_Dup2: CAP CERAMIC 0.1uF 16V 10% X5R 0201; Part_type: CAPACITORS\CERAMIC; Mfr_part_number: GRM033R61C104KE14D; Mfr_name: MURATA; Mistral Part No: 120009030072-R; Custom_Duty: 15%; Customs_HS_Code: 85322990; Wattage: NA; Project: TI_MAXIE_CPB; PCB Footprint: CAP0201_0-5; Footprint Path: Y:\MIS_DATABASE\Library\ALTIUM_TOOL\PCB_FOOTPRINTS\Altium_Footprint_Lib.PcbLib; Library Path: Y:\MIS_DATABASE\Library\ALTIUM_TOOL\SCHEMATICS_PARTS\MS_DISCRETE_Library.schlib; MECHANICAL 3D STEP FILE: CAP0201_0-5; Chkd/date: MANIRAJA/230118; Crtd /date: MANIRAJA/230118; Datasheet: Y:\MIS_DATABASE\DATASHEETS\CAPACITORS\GRM033R61C104KE14.PDF; Temperature: -55°C+85°C; Weight: 0.33mg; Height: 0.33MM; Footprint Ref: CAP0201_0-5; Library Ref: CAP; Distributor_part_number: 490-14305-1-ND; Distributor_name: DIGIKEY; Package: 0201; Voltage: 16V; Tolerance: 10%
C135 C136 C151 C152 = CAP_Dup2: CAP CERAMIC 220pF 100V 5% C0G(NP0) 0402; Part_type: CAPACITORS\CERAMIC; Mfr_part_number: GRM1555C2A221JE01D; Mfr_name: MURATA; Mistral Part No: 120021100001-R; Custom_Duty: 15%; Customs_HS_Code: 85322990; Wattage: NA; Project: TI_AM62x SKEVM_BRD; PCB Footprint: CAP0402_0-75; Footprint Path: Y:\MIS_DATABASE\Library\ALTIUM_TOOL\PCB_FOOTPRINTS\Altium_Footprint_Lib.PcbLib; Library Path: Y:\MIS_DATABASE\Library\ALTIUM_TOOL\SCHEMATICS_PARTS\MS_DISCRETE_Library.schlib; MECHANICAL 3D STEP FILE: CAP0402_0-75; Chkd/date: MANIRAJA/061021; Crtd /date: ALVY/051021; Datasheet: Y:\MIS_DATABASE\DATASHEETS\CAPACITORS\GRM1555C2A221JE01.PDF; Temperature: -55°C+125°C; Weight: 1.6mg; Height: 0.55MM; Library Ref: CAP; Distributor_part_number: 490-GRM1555C2A221JE01DTR-ND; Distributor_name: DIGIKEY; Package: 0402; Voltage: 100V; Tolerance: 5%; Footprint Ref: CAP0402_0-75
C138 = CAP_Dup2: CAP CERAMIC 4.7uF 10V 20% X5R 0402; Part_type: CAPACITORS\CERAMIC; Mfr_part_number: GRM155R61A475MEAAD; Mfr_name: MURATA; Mistral Part No: 120012060002-R; Custom_Duty: 15%; Customs_HS_Code: 85322990; Wattage: NA; Project: TI_J7SVB_PCIE_ADD-ON-CARD; PCB Footprint: CAP0402_0-75; Footprint Path: Y:\MIS_DATABASE\Library\ALTIUM_TOOL\PCB_FOOTPRINTS\Altium_Footprint_Lib.PcbLib; Library Path: Y:\MIS_DATABASE\Library\ALTIUM_TOOL\SCHEMATICS_PARTS\MS_DISCRETE_Library.schlib; MECHANICAL 3D STEP FILE: CAP0402_0-75; Chkd/date: MANIRAJA/110718; Crtd /date: ALVY/110718; Datasheet: Y:\MIS_DATABASE\DATASHEETS\CAPACITORS\GRM155R61A475MEAAD.PDF; Temperature: -55°C+85°C; Weight: 14mg; Height: 0.65MM; Library Ref: CAP; Distributor_part_number: 490-14306-1-ND; Distributor_name: DIGIKEY; Package: 0402; Voltage: 10V; Tolerance: 20%; Footprint Ref: CAP0402_0-75
C139 C147 = CAP_Dup2: CAP CERAMIC 0.1uF 50V 10% X7R 0402; Mistral Part No: 120011100014-R; Mfr_name: MURATA; Mfr_part_number: GRM155R71H104KE14D; Part_type: CAPACITORS\CERAMIC; Project: J7_CP; Wattage: NA; Customs_HS_Code: 85322990; Custom_Duty: 15%; PCB Footprint: CAP0402_0-75; Footprint Ref: CAP0402_0-75; Tolerance: 10%; Voltage: 50V; Package: 0402; Distributor_name: DIGIKEY; Distributor_part_number: 490-10700-1-ND; Library Ref: CAP; Height: 0.55MM; Weight: 3.1mg; Temperature: -55°C+125°C; Datasheet: Y:\MIS_DATABASE\DATASHEETS\CAPACITORS\GRM155R71H104KE14.PDF; Crtd /date: ALVY/211020; Chkd/date: MANIRAJA/261020; MECHANICAL 3D STEP FILE: CAP0402_0-75; Library Path: Y:\MIS_DATABASE\Library\ALTIUM_TOOL\SCHEMATICS_PARTS\MS_DISCRETE_Library.schlib; Footprint Path: Y:\MIS_DATABASE\Library\ALTIUM_TOOL\PCB_FOOTPRINTS\Altium_Footprint_Lib.PcbLib
C141 C432 = CAP_Dup2: CAP CERAMIC 10uF 35V 20% X5R 0603; Part_type: CAPACITORS\CERAMIC; Mfr_part_number: GRM188R6YA106MA73D; Mfr_name: MURATA; Mistral Part No: 120019050016-R; Custom_Duty: 15%; Customs_HS_Code: 85322990; Wattage: NA; Project: BRUKER_SD820_COMMONDO; PCB Footprint: CAP0603_1; Footprint Path: Y:\MIS_DATABASE\Library\ALTIUM_TOOL\PCB_FOOTPRINTS\Altium_Footprint_Lib.PcbLib; Library Path: Y:\MIS_DATABASE\Library\ALTIUM_TOOL\SCHEMATICS_PARTS\MS_DISCRETE_Library.schlib; MECHANICAL 3D STEP FILE: CAP0603_1; Chkd/date: MANIRAJA/170519; Crtd /date: ALVY/160519; Datasheet: Y:\MIS_DATABASE\DATASHEETS\CAPACITORS\GRM188R6YA106MA73.PDF; Temperature: -55°C+85°C; Weight: 9mg; Height: 1.00MM; Library Ref: CAP; Distributor_part_number: 490-13248-1-ND; Distributor_name: DIGIKEY; Package: 0603; Voltage: 35V; Tolerance: 20%; Footprint Ref: CAP0603_1
C142 C144 = CAP_Dup2: CAP CERAMIC 10uF 10V 20% X5R 0402; Part_type: CAPACITORS\CERAMIC; Mfr_part_number: GRM155R61A106ME11D; Mfr_name: MURATA; Mistral Part No: 120013110019-R; Custom_Duty: 15%; Customs_HS_Code: 85322990; Wattage: NA; Project: QCS610_NANOSOM; PCB Footprint: CAP0402_0-75; Footprint Path: Y:\MIS_DATABASE\Library\ALTIUM_TOOL\PCB_FOOTPRINTS\Altium_Footprint_Lib.PcbLib; Library Path: Y:\MIS_DATABASE\Library\ALTIUM_TOOL\SCHEMATICS_PARTS\MS_DISCRETE_Library.schlib; MECHANICAL 3D STEP FILE: CAP0402_0-75; Chkd/date: MANIRAJA/300520; Crtd /date: ALVY/260520; Datasheet: Y:\MIS_DATABASE\DATASHEETS\CAPACITORS\MURATA-GXX-SER_NOV17.PDF; Temperature: -55°C+85°C; Weight: 3.1mg; Height: 0.55MM; Library Ref: CAP; Distributor_part_number: 490-GRM155R61A106ME11DTR-ND; Distributor_name: DIGIKEY; Package: 0402; Voltage: 10V; Tolerance: 20%; Footprint Ref: CAP0402_0-75
C143 C423 = CAP_Dup2: CAP CERAMIC 4.7uF 10V 20% X5R 0402; Mistral Part No: 120012060002-R; Mfr_name: MURATA; Mfr_part_number: GRM155R61A475MEAAD; Part_type: CAPACITORS\CERAMIC; Project: TI_J7SVB_PCIE_ADD-ON-CARD; Wattage: NA; Customs_HS_Code: 85322990; Custom_Duty: 15%; PCB Footprint: CAP0402_0-75; Footprint Ref: CAP0402_0-75; Tolerance: 20%; Voltage: 10V; Package: 0402; Distributor_name: DIGIKEY; Distributor_part_number: 490-14306-1-ND; Library Ref: CAP; Height: 0.65MM; Weight: 14mg; Temperature: -55°C+85°C; Datasheet: Y:\MIS_DATABASE\DATASHEETS\CAPACITORS\GRM155R61A475MEAAD.PDF; Crtd /date: ALVY/110718; Chkd/date: MANIRAJA/110718; MECHANICAL 3D STEP FILE: CAP0402_0-75; Library Path: Y:\MIS_DATABASE\Library\ALTIUM_TOOL\SCHEMATICS_PARTS\MS_DISCRETE_Library.schlib; Footprint Path: Y:\MIS_DATABASE\Library\ALTIUM_TOOL\PCB_FOOTPRINTS\Altium_Footprint_Lib.PcbLib
C150 C433 = CAP_Dup2: CAP CERAMIC 10uF 35V 20% X5R 0603; Mistral Part No: 120019050016-R; Mfr_name: MURATA; Mfr_part_number: GRM188R6YA106MA73D; Part_type: CAPACITORS\CERAMIC; Project: BRUKER_SD820_COMMONDO; Wattage: NA; Customs_HS_Code: 85322990; Custom_Duty: 15%; PCB Footprint: CAP0603_1; Footprint Ref: CAP0603_1; Tolerance: 20%; Voltage: 35V; Package: 0603; Distributor_name: DIGIKEY; Distributor_part_number: 490-13248-1-ND; Library Ref: CAP; Height: 1.00MM; Weight: 9mg; Temperature: -55°C+85°C; Datasheet: Y:\MIS_DATABASE\DATASHEETS\CAPACITORS\GRM188R6YA106MA73.PDF; Crtd /date: ALVY/160519; Chkd/date: MANIRAJA/170519; MECHANICAL 3D STEP FILE: CAP0603_1; Library Path: Y:\MIS_DATABASE\Library\ALTIUM_TOOL\SCHEMATICS_PARTS\MS_DISCRETE_Library.schlib; Footprint Path: Y:\MIS_DATABASE\Library\ALTIUM_TOOL\PCB_FOOTPRINTS\Altium_Footprint_Lib.PcbLib
C153 = CAP_Dup2: CAP CERAMIC 0.1uF 50V 10% X7R 0402; Part_type: CAPACITORS\CERAMIC; Mfr_part_number: GRM155R71H104KE14D; Mfr_name: MURATA; Mistral Part No: 120011100014-R; Custom_Duty: 15%; Customs_HS_Code: 85322990; Wattage: NA; Project: J7_CP; PCB Footprint: CAP0402_0-75; Footprint Path: Y:\MIS_DATABASE\Library\ALTIUM_TOOL\PCB_FOOTPRINTS\Altium_Footprint_Lib.PcbLib; Library Path: Y:\MIS_DATABASE\Library\ALTIUM_TOOL\SCHEMATICS_PARTS\MS_DISCRETE_Library.schlib; MECHANICAL 3D STEP FILE: CAP0402_0-75; Chkd/date: MANIRAJA/261020; Crtd /date: ALVY/211020; Datasheet: Y:\MIS_DATABASE\DATASHEETS\CAPACITORS\GRM155R71H104KE14.PDF; Temperature: -55°C+125°C; Weight: 3.1mg; Height: 0.55MM; Library Ref: CAP; Distributor_part_number: 490-10700-1-ND; Distributor_name: DIGIKEY; Package: 0402; Voltage: 50V; Tolerance: 10%; Footprint Ref: CAP0402_0-75
C392 = CAP_Dup2: CAP CERAMIC 1000pF 2KV 10% X7R 1206; Part_type: CAPACITORS\CERAMIC; Mfr_part_number: 1206GC102KAT1A; Mfr_name: AVX CORPORATION; Mistral Part No: 120015080006-R; Wattage: NA; Custom_Duty: 15%; Customs_HS_Code: 85322990; Project: ADR1B; PCB Footprint: CAP1206_1-75; MECHANICAL 3D STEP FILE: CAP1206_1-75; Footprint Path: Y:\MIS_DATABASE\Library\ALTIUM_TOOL\PCB_FOOTPRINTS\Altium_Footprint_Lib.PcbLib; Library Path: Y:\MIS_DATABASE\Library\ALTIUM_TOOL\SCHEMATICS_PARTS\MS_DISCRETE_Library.schlib; Footprint Ref: CAP1206_1-75; Library Ref: CAP; Chkd/date: SHREESHAIL/291106; Crtd /date: MAZHAR/281106; Datasheet: Y:\MIS_DATABASE\DATASHEETS\CAPACITORS\AVX_HV-MLC.PDF; Temperature: -55°C+125°C; Weight: 16.2mg; Height: 1.52MM; Distributor_part_number: 478-2956-1-ND; Distributor_name: DIGIKEY; Package: 1206; Voltage: 2KV; Tolerance: 10%
C398 C415 = CAP_Dup2: CAP CERAMIC 1uF 100V 10% X7S 0805; Mistral Part No: 120013030002-R; Mfr_name: MURATA; Mfr_part_number: GRM21BC72A105KE01L; Part_type: CAPACITORS\CERAMIC; Project: TI_AM62x SKEVM_BRD; Wattage: NA; Customs_HS_Code: 85322990; Custom_Duty: 15%; PCB Footprint: CAP0805_1-5; Footprint Ref: CAP0805_1-5; Tolerance: 10%; Voltage: 100V; Package: 0805; Distributor_name: DIGIKEY; Distributor_part_number: 490-14464-1-ND; Library Ref: CAP; Height: 1.45MM; Weight: 6.4mg; Temperature: -55°C+125°C; Datasheet: Y:\MIS_DATABASE\DATASHEETS\CAPACITORS\GRM21BC72A105KE01.PDF; Crtd /date: ALVY/150921; Chkd/date: MANIRAJA/160921; MECHANICAL 3D STEP FILE: CAP0805_1-5; Library Path: Y:\MIS_DATABASE\Library\ALTIUM_TOOL\SCHEMATICS_PARTS\MS_DISCRETE_Library.schlib; Footprint Path: Y:\MIS_DATABASE\Library\ALTIUM_TOOL\PCB_FOOTPRINTS\Altium_Footprint_Lib.PcbLib
C401 = CAP_Dup2: CAP CERAMIC 0.01uF 25V 10% X5R 0201; Mistral Part No: 120018010007-R; Mfr_name: MURATA; Mfr_part_number: GRM033R61E103KA12J; Part_type: CAPACITORS\CERAMIC; Project: TI_MAXIE_CPB; Wattage: NA; Customs_HS_Code: 85322990; Custom_Duty: 15%; PCB Footprint: CAP0201_0-5; Footprint Ref: CAP0201_0-5; Tolerance: 10%; Voltage: 25V; Package: 0201; Distributor_name: DIGIKEY; Distributor_part_number: GRM033R61E103KA12J-ND; Library Ref: CAP; Height: 0.33MM; Weight: 0.33mg; Temperature: -55°C+85°C; Datasheet: Y:\MIS_DATABASE\DATASHEETS\CAPACITORS\GRM033R61E103KA12.PDF; Crtd /date: MANIRAJA/230118; Chkd/date: MANIRAJA/230118; MECHANICAL 3D STEP FILE: CAP0201_0-5; Library Path: Y:\MIS_DATABASE\Library\ALTIUM_TOOL\SCHEMATICS_PARTS\MS_DISCRETE_Library.schlib; Footprint Path: Y:\MIS_DATABASE\Library\ALTIUM_TOOL\PCB_FOOTPRINTS\Altium_Footprint_Lib.PcbLib
C409 = CAP_Dup2: CAP CERAMIC 0.01uF 25V 10% X5R 0201; Part_type: CAPACITORS\CERAMIC; Mfr_part_number: GRM033R61E103KA12J; Mfr_name: MURATA; Mistral Part No: 120018010007-R; Custom_Duty: 15%; Customs_HS_Code: 85322990; Wattage: NA; Project: TI_MAXIE_CPB; PCB Footprint: CAP0201_0-5; Footprint Path: Y:\MIS_DATABASE\Library\ALTIUM_TOOL\PCB_FOOTPRINTS\Altium_Footprint_Lib.PcbLib; Library Path: Y:\MIS_DATABASE\Library\ALTIUM_TOOL\SCHEMATICS_PARTS\MS_DISCRETE_Library.schlib; MECHANICAL 3D STEP FILE: CAP0201_0-5; Chkd/date: MANIRAJA/230118; Crtd /date: MANIRAJA/230118; Datasheet: Y:\MIS_DATABASE\DATASHEETS\CAPACITORS\GRM033R61E103KA12.PDF; Temperature: -55°C+85°C; Weight: 0.33mg; Height: 0.33MM; Library Ref: CAP; Distributor_part_number: GRM033R61E103KA12J-ND; Distributor_name: DIGIKEY; Package: 0201; Voltage: 25V; Tolerance: 10%; Footprint Ref: CAP0201_0-5
C435 = CAP_Dup2: CAP CERAMIC 0.1uF 16V 10% X5R 0201; Mistral Part No: 120009030072-R; Mfr_name: MURATA; Mfr_part_number: GRM033R61C104KE14D; Part_type: CAPACITORS\CERAMIC; Project: TI_MAXIE_CPB; Wattage: NA; Customs_HS_Code: 85322990; Custom_Duty: 15%; PCB Footprint: CAP0201_0-5; Footprint Ref: CAP0201_0-5; Tolerance: 10%; Voltage: 16V; Package: 0201; Distributor_name: DIGIKEY; Distributor_part_number: 490-14305-1-ND; Library Ref: CAP; Height: 0.33MM; Weight: 0.33mg; Temperature: -55°C+85°C; Datasheet: Y:\MIS_DATABASE\DATASHEETS\CAPACITORS\GRM033R61C104KE14.PDF; Crtd /date: MANIRAJA/230118; Chkd/date: MANIRAJA/230118; MECHANICAL 3D STEP FILE: CAP0201_0-5; Library Path: Y:\MIS_DATABASE\Library\ALTIUM_TOOL\SCHEMATICS_PARTS\MS_DISCRETE_Library.schlib; Footprint Path: Y:\MIS_DATABASE\Library\ALTIUM_TOOL\PCB_FOOTPRINTS\Altium_Footprint_Lib.PcbLib
D2 D9 = DIODE_TVS_DUAL: DIODE 1CH ESD PROTECTION FOR USB TYPE-C AND THUNDERBOLT3 X2SON2; Mistral Part No: 130020090037-R; Mfr_name: TEXAS INSTRUMENTS; Part_type: DIODE\TVS; Project: AM64X_SKEVM; Tolerance: NA; Customs_HS_Code: 85412900; Custom_Duty: 15%; PCB Footprint: DIO_DFN0201_0-4; Footprint Ref: DIO_DFN0201_0-4; Mfr_part_number: TPD1E01B04DPLT; Voltage: NA; Wattage: NA; Package: X2SON2; Distributor_name: DIGIKEY; Distributor_part_number: 296-44484-1-ND; Library Ref: DIODE_TVS_DUAL; Height: 0.32MM; Weight: 0.2mg; Temperature: -40°C+125°C; Datasheet: Y:\MIS_DATABASE\DATASHEETS\DISCRETES\DIODES\TPD1E01B04.PDF; Crtd /date: ALVY/230920; Chkd/date: MANIRAJA/230920; MECHANICAL 3D STEP FILE: DIO_DFN0201_0-4; Library Path: Y:\MIS_DATABASE\Library\ALTIUM_TOOL\SCHEMATICS_PARTS\MS_DISCRETE_Library.schlib; Footprint Path: Y:\MIS_DATABASE\Library\ALTIUM_TOOL\PCB_FOOTPRINTS\Altium_Footprint_Lib.PcbLib
J11 = CON_USB-C_24_1240183621: CON USB-C TYPE 24POS FEMALE RT SMD; Part_type: CONNECTOR\USB; Mfr_part_number: 2012670005; Mfr_name: MOLEX; Mistral Part No: 150018060002-R; Custom_Duty: 24%; Customs_HS_Code: 85369090; Wattage: NA; Project: TI_J7SVB_USB_ADD-ON-CARD; PCB Footprint: CON_USBC24_2012670_S_R_S_3-9; Footprint Path: Y:\MIS_DATABASE\Library\ALTIUM_TOOL\PCB_FOOTPRINTS\Altium_Footprint_Lib.PcbLib; Library Path: Y:\MIS_DATABASE\Library\ALTIUM_TOOL\SCHEMATICS_PARTS\MS_CONNECTOR_Library.schlib; MECHANICAL 3D STEP FILE: CON_USBC24_2012670_S_R_S_3-9; Chkd/date: MANIRAJA/050618; Crtd /date: ALVY/040618; Datasheet: Y:\MIS_DATABASE\DATASHEETS\CONNECTORS\2012670X.PDF; Temperature: -40°C+105°C; Weight: 0.686g; Height: 3.86MM; Library Ref: CON_USB-C_24_1240183621; Distributor_part_number: WM17992CT-ND; Distributor_name: DIGIKEY; Package: SMD; Voltage: NA; Tolerance: NA; Footprint Ref: CON_USBC24_2012670_S_R_S_3-9
J22 = HEADER_5X2: CON HDR 2X5 2.54MM PITCH ST TH; Mistral Part No: 150021080010-R; Mfr_name: SULLINS CONNECTOR; Mfr_part_number: PEC05DAAN; Part_type: CONNECTOR\HEADERS; Project: TI_AM335x SK_BRD; Tolerance: NA; Customs_HS_Code: 85369090; Custom_Duty: 24%; PCB Footprint: HDR_2X5_PEC05DAAN_S_T_8-6; Footprint Ref: HDR_2X5_PEC05DAAN_S_T_8-6; Voltage: NA; Wattage: NA; Package: THRU-HOLE; Distributor_name: DIGIKEY; Distributor_part_number: S2012E-05-ND; Library Ref: HEADER_5X2; Height: 8.58MM; Weight: NA; Temperature: -65°C+125°C; Datasheet: Y:\MIS_DATABASE\DATASHEETS\CONNECTORS\XXCXXDXXN.PDF; Crtd /date: ALVY/060821; Chkd/date: MANIRAJA/060821; MECHANICAL 3D STEP FILE: HDR_2X5_PEC05DAAN_S_T_8-6; Library Path: Y:\MIS_DATABASE\Library\ALTIUM_TOOL\SCHEMATICS_PARTS\MS_CONNECTOR_Library.schlib; Footprint Path: Y:\MIS_DATABASE\Library\ALTIUM_TOOL\PCB_FOOTPRINTS\Altium_Footprint_Lib.PcbLib
LD10 = DIODE_LED: DIODE LED BRIGHT GREEN SMD; Mistral Part No: 130020080012-R; Mfr_name: WURTH ELECTRONICS; Part_type: OPTO\LED; Project: AM64x_EVM_BRD; Tolerance: NA; Customs_HS_Code: 85439000; Custom_Duty: 24%; PCB Footprint: LED_150080VS75000_80X50_SMD_0-8; Footprint Ref: LED_150080VS75000_80X50_SMD_0-8; Mfr_part_number: 150080VS75000; Voltage: NA; Wattage: NA; Package: SMD; Distributor_name: DIGIKEY; Distributor_part_number: 732-4986-1-ND; Library Ref: DIODE_LED; Height: 0.80MM; Weight: 10mg; Temperature: -40°C+85°C; Datasheet: Y:\MIS_DATABASE\DATASHEETS\DISCRETES\LEDS\150080VS75000.PDF; Crtd /date: ALVY/180820; Chkd/date: MANIRAJA/180820; MECHANICAL 3D STEP FILE: LED_150080VS75000_80X50_SMD_0-8; Library Path: Y:\MIS_DATABASE\Library\ALTIUM_TOOL\SCHEMATICS_PARTS\MS_OPTO_Library.schlib; Footprint Path: Y:\MIS_DATABASE\Library\ALTIUM_TOOL\PCB_FOOTPRINTS\Altium_Footprint_Lib.PcbLib
Q13 = MOSFET_CSD17313Q2: IC MOSFET N-CHANNEL NEXFET 25V WSON6; Part_type: ICS\POWER\MOSFET; Mfr_name: TEXAS INSTRUMENTS; Mistral Part No: 142020120008-R; Custom_Duty: 15%; Customs_HS_Code: 85423100; Wattage: NA; Project: TI_AM243x LP EVM; PCB Footprint: WSON6_CSD13202Q2_80X80_0-8; Footprint Path: Y:\MIS_DATABASE\Library\ALTIUM_TOOL\PCB_FOOTPRINTS\Altium_Footprint_Lib.PcbLib; Library Path: Y:\MIS_DATABASE\Library\ALTIUM_TOOL\SCHEMATICS_PARTS\MS_MOSFET_Library.schlib; MECHANICAL 3D STEP FILE: WSON6_CSD13202Q2_80X80_0-8; Chkd/date: ALVY/071220; Crtd /date: MANIRAJA/071220; Datasheet: Y:\MIS_DATABASE\DATASHEETS\ICS\POWER\CSD16301Q2.PDF; Temperature: -55°C+150°C; Weight: 8.7mg; Height: 0.80MM; Library Ref: MOSFET_CSD17313Q2; Distributor_part_number: 296-25260-1-ND; Distributor_name: DIGIKEY; Package: WSON6; Voltage: NA; Tolerance: NA; Mfr_part_number: CSD16301Q2; Footprint Ref: WSON6_CSD13202Q2_80X80_0-8
Q14 = MOSFET_CSD25310Q2: IC MOSFET P-CHANNEL WSON6; Part_type: ICS\POWER\MOSFET; Mfr_name: TEXAS INSTRUMENTS; Mistral Part No: 142015120011-R; Custom_Duty: 15%; Customs_HS_Code: 85423100; Wattage: NA; Project: DUET BOARD; PCB Footprint: SON6_CSD17313Q2_80X80; Chkd/date: VASANTHA/191215; Crtd /date: VASANTHA/191215; Datasheet: Y:\MIS_DATABASE\DATASHEETS\DISCRETES\TRANSISTORS_FETS\CSD25310Q2.PDF; Temperature: -55°C+150°C; Weight: NA; Height: 0.85MM; Library Ref: MOSFET_CSD25310Q2; Distributor_part_number: 296-38915-1-ND; Distributor_name: DIGIKEY; Package: WSON6; Voltage: NA; Tolerance: NA; Mfr_part_number: CSD25310Q2
Q16 = MOSFET_CSD25310Q2: IC MOSFET P-CHANNEL WSON6; Mistral Part No: 142015120011-R; Mfr_name: TEXAS INSTRUMENTS; Part_type: ICS\POWER\MOSFET; Project: DUET BOARD; Tolerance: NA; Customs_HS_Code: 85423100; Custom_Duty: 15%; PCB Footprint: SON6_CSD17313Q2_80X80; Mfr_part_number: CSD25310Q2; Voltage: NA; Wattage: NA; Package: WSON6; Distributor_name: DIGIKEY; Distributor_part_number: 296-38915-1-ND; Library Ref: MOSFET_CSD25310Q2; Height: 0.85MM; Weight: NA; Temperature: -55°C+150°C; Datasheet: Y:\MIS_DATABASE\DATASHEETS\DISCRETES\TRANSISTORS_FETS\CSD25310Q2.PDF; Crtd /date: VASANTHA/191215; Chkd/date: VASANTHA/191215
R157 R158 R163 R164 R460 R464 R478 R482 R492 R625 R695 = RESISTOR_Dup6: RES 0E 1/20W 5% 0201; Part_type: RESISTORS\FIXED; Mfr_part_number: RC0201JR-070RL; Mfr_name: YAGEO AMERICA; Mistral Part No: 110010070067-R; Custom_Duty: 15%; Customs_HS_Code: 85332119; Voltage: NA; Project: PB_BUGBASE; PCB Footprint: RES0201_0-5; Footprint Path: Y:\MIS_DATABASE\Library\ALTIUM_TOOL\PCB_FOOTPRINTS\Altium_Footprint_Lib.PcbLib; Library Path: Y:\MIS_DATABASE\Library\ALTIUM_TOOL\SCHEMATICS_PARTS\MS_DISCRETE_Library.schlib; MECHANICAL 3D STEP FILE: RES0201_0-5; Chkd/date: NAVEED/301214; Crtd /date: MUDDU/120710; Datasheet: Y:\MIS_DATABASE\DATASHEETS\RESISTORS\RCXXXXL-SER_MAR18.PDF; Temperature: -55°C+125°C; Weight: 0.17mg; Height: 0.26MM; Library Ref: RESISTOR; Distributor_part_number: 311-0.0NCT-ND; Distributor_name: DIGIKEY; Package: 0201; Wattage: 1/20W; Tolerance: 5%; Footprint Ref: RES0201_0-5
R177 R181 R184 R185 R450-R452 R696 = RESISTOR_Dup6: RES 10K 1/20W 5% 0201; Part_type: RESISTORS\FIXED; Mfr_part_number: RC0201JR-0710KL; Mfr_name: YAGEO AMERICA; Mistral Part No: 110010070051-R; Custom_Duty: 15%; Customs_HS_Code: 85332119; Voltage: NA; Project: GOLDEN-I LITE; PCB Footprint: RES0201_0-5; MECHANICAL 3D STEP FILE: RES0201_0-5; Chkd/date: MANIRAJA/050517; Crtd /date: MANIRAJA/050517; Datasheet: Y:\MIS_DATABASE\DATASHEETS\RESISTORS\RCXXXXL-SER_MAR18.PDF; Temperature: -55°C+125°C; Weight: 0.17mg; Height: 0.26MM; Distributor_part_number: 311-10KNCT-ND; Distributor_name: DIGIKEY; Package: 0201; Wattage: 1/20W; Tolerance: 5%; Library Ref: RESISTOR; Footprint Ref: RES0201_0-5; Library Path: Y:\MIS_DATABASE\Library\ALTIUM_TOOL\SCHEMATICS_PARTS\MS_DISCRETE_Library.schlib; Footprint Path: Y:\MIS_DATABASE\Library\ALTIUM_TOOL\PCB_FOOTPRINTS\Altium_Footprint_Lib.PcbLib
R178 = RESISTOR_Dup6: RES 0E 1/10W 5% 0603; Manufacturer: YAGEO AMERICA; Mistral Part No: 110011020013-R; Mfr_name: PANASONIC-ECG; Mfr_part_number: RC0603JR-070RL; Part_type: RESISTORS\FIXED; Project: KENNEL; Voltage: NA; Customs_HS_Code: 85332119; Custom_Duty: 15%; PCB Footprint: RES0603_0-75; Footprint Path: Y:\MIS_DATABASE\Library\ALTIUM_TOOL\PCB_FOOTPRINTS\Altium_Footprint_Lib.PcbLib; Library Path: Y:\MIS_DATABASE\Library\ALTIUM_TOOL\SCHEMATICS_PARTS\MS_DISCRETE_Library.schlib; Footprint Ref: RES0603_0-75; Library Ref: RESISTOR; Tolerance: 5%; Wattage: 1/10W; Package: 0603; Distributor_name: DIGIKEY; Distributor_part_number: 311-0.0GRCT-ND; Height: 0.55MM; Weight: 2mg; Temperature: -55°C+155°C; Datasheet: Y:\MIS_DATABASE\DATASHEETS\RESISTORS\RCXXXXL-SER_MAR18.PDF; Crtd /date: BAVISH/180211; Chkd/date: MANIRAJA/051217; MECHANICAL 3D STEP FILE: RES0603_0-75
R179 R180 R457 = RESISTOR_Dup6: RES 10K 1/20W 5% 0201; Mistral Part No: 110010070051-R; Mfr_name: YAGEO AMERICA; Mfr_part_number: RC0201JR-0710KL; Part_type: RESISTORS\FIXED; Project: GOLDEN-I LITE; Voltage: NA; Customs_HS_Code: 85332119; Custom_Duty: 15%; PCB Footprint: RES0201_0-5; Footprint Path: Y:\MIS_DATABASE\Library\ALTIUM_TOOL\PCB_FOOTPRINTS\Altium_Footprint_Lib.PcbLib; Library Path: Y:\MIS_DATABASE\Library\ALTIUM_TOOL\SCHEMATICS_PARTS\MS_DISCRETE_Library.schlib; Footprint Ref: RES0201_0-5; Library Ref: RESISTOR; Tolerance: 5%; Wattage: 1/20W; Package: 0201; Distributor_name: DIGIKEY; Distributor_part_number: 311-10KNCT-ND; Height: 0.26MM; Weight: 0.17mg; Temperature: -55°C+125°C; Datasheet: Y:\MIS_DATABASE\DATASHEETS\RESISTORS\RCXXXXL-SER_MAR18.PDF; Crtd /date: MANIRAJA/050517; Chkd/date: MANIRAJA/050517; MECHANICAL 3D STEP FILE: RES0201_0-5
R182 = RESISTOR_Dup6: RES 1K 1/10W 1% 0402; Mistral Part No: 110009030411-R; Mfr_name: PANASONIC-ECG; Mfr_part_number: ERJ-2RKF1001X; Part_type: RESISTORS\FIXED; Project: VOCERA; Voltage: NA; Customs_HS_Code: 85332119; Custom_Duty: 15%; PCB Footprint: RES0402_0-5; Footprint Ref: RES0402_0-5; Tolerance: 1%; Wattage: 1/10W; Package: 0402; Distributor_name: DIGIKEY; Distributor_part_number: P1.00KLCT-ND; Library Ref: RESISTOR; Height: 0.40MM; Weight: 0.8mg; Temperature: -55°C+155°C; Datasheet: Y:\MIS_DATABASE\DATASHEETS\RESISTORS\PAN-ERJSER_NOV17.PDF; Crtd /date: MAZHAR/150506; Chkd/date: VASANTHA/281216; MECHANICAL 3D STEP FILE: RES0402_0-5; Library Path: Y:\MIS_DATABASE\Library\ALTIUM_TOOL\SCHEMATICS_PARTS\MS_DISCRETE_Library.schlib; Footprint Path: Y:\MIS_DATABASE\Library\ALTIUM_TOOL\PCB_FOOTPRINTS\Altium_Footprint_Lib.PcbLib
R223 = RESISTOR_Dup6: RES 10K 1/20W 1% 0201; Mistral Part No: 110018060032-R; Mfr_name: VISHAY; Mfr_part_number: CRCW020110K0FNED; Part_type: RESISTORS\FIXED; Project: NEXTNAV_LPRX_BOARD; Voltage: NA; Customs_HS_Code: 85332119; Custom_Duty: 15%; PCB Footprint: RES0201_0-5; Footprint Ref: RES0201_0-5; Tolerance: 1%; Wattage: 1/20W; Package: 0201; Distributor_name: DIGIKEY; Distributor_part_number: 541-10.0KABCT-ND; Library Ref: RESISTOR; Height: 0.28MM; Weight: 0.17mg; Temperature: -55°C+155°C; Datasheet: Y:\MIS_DATABASE\DATASHEETS\RESISTORS\CRCW0201.PDF; Crtd /date: ALVY/260618; Chkd/date: MANIRAJA/260618; MECHANICAL 3D STEP FILE: RES0201_0-5; Library Path: Y:\MIS_DATABASE\Library\ALTIUM_TOOL\SCHEMATICS_PARTS\MS_DISCRETE_Library.schlib; Footprint Path: Y:\MIS_DATABASE\Library\ALTIUM_TOOL\PCB_FOOTPRINTS\Altium_Footprint_Lib.PcbLib
R449 = RESISTOR_Dup6: RES 1M 1/16W 1% 0402; Mistral Part No: 110014060045-R; Mfr_name: YAGEO AMERICA; Mfr_part_number: RC0402FR-071ML; Part_type: RESISTORS\FIXED; Project: G4SLIM; Voltage: NA; Customs_HS_Code: 85332119; Custom_Duty: 15%; PCB Footprint: RES0402_0-5; Tolerance: 1%; Wattage: 1/16W; Package: 0402; Distributor_name: DIGIKEY; Distributor_part_number: 311-1.00MLRCT-ND; Library Ref: RESISTOR; Footprint Ref: RES0402_0-5; Height: 0.40MM; Weight: 0.65mg; Temperature: -55°C+155°C; Datasheet: Y:\MIS_DATABASE\DATASHEETS\RESISTORS\RCXXXXL-SER_MAR18.PDF; Crtd /date: MANIRAJA/190319; Chkd/date: MANIRAJA/190319; MECHANICAL 3D STEP FILE: RES0402_0-5; Library Path: Y:\MIS_DATABASE\Library\ALTIUM_TOOL\SCHEMATICS_PARTS\MS_DISCRETE_Library.schlib; Footprint Path: Y:\MIS_DATABASE\Library\ALTIUM_TOOL\PCB_FOOTPRINTS\Altium_Footprint_Lib.PcbLib
R465 = RESISTOR_Dup6: RES 100K 1/10W 1% 0402; Mistral Part No: 110009030187-R; Mfr_name: PANASONIC-ECG; Mfr_part_number: ERJ-2RKF1003X; Part_type: RESISTORS\FIXED; Project: J32; Voltage: NA; Customs_HS_Code: 85332119; Custom_Duty: 15%; PCB Footprint: RES0402_0-5; Footprint Ref: RES0402_0-5; Tolerance: 1%; Wattage: 1/10W; Package: 0402; Distributor_name: DIGIKEY; Distributor_part_number: P100KLCT-ND; Library Ref: RESISTOR; Height: 0.40MM; Weight: 0.8mg; Temperature: -55°C+155°C; Datasheet: Y:\MIS_DATABASE\DATASHEETS\RESISTORS\PAN-ERJSER_NOV17.PDF; Crtd /date: MAZHAR/130306; Chkd/date: VASANTHA/201216; MECHANICAL 3D STEP FILE: RES0402_0-5; Library Path: Y:\MIS_DATABASE\Library\ALTIUM_TOOL\SCHEMATICS_PARTS\MS_DISCRETE_Library.schlib; Footprint Path: Y:\MIS_DATABASE\Library\ALTIUM_TOOL\PCB_FOOTPRINTS\Altium_Footprint_Lib.PcbLib
R466 = RESISTOR_Dup6: RES 0E 1/20W JUMPER 0201; Mistral Part No: 110009030078-R; Mfr_name: PANASONIC-ECG; Mfr_part_number: ERJ-1GE0R00C; Part_type: RESISTORS\FIXED; Project: HS100RD; Tolerance: NA; Customs_HS_Code: 85332119; Custom_Duty: 15%; PCB Footprint: RES0201_0-5; Footprint Ref: RES0201_0-5; Voltage: NA; Wattage: 1/20W; Package: 0201; Distributor_name: DIGIKEY; Distributor_part_number: P0.0AGCT-ND; Library Ref: RESISTOR; Height: 0.26MM; Weight: 0.15mg; Temperature: -55°C+125°C; Datasheet: Y:\MIS_DATABASE\DATASHEETS\RESISTORS\PAN-ERJXGE-FEB06.PDF; Crtd /date: MAZHAR/040505; Chkd/date: VASANTHA/061216; MECHANICAL 3D STEP FILE: RES0201_0-5; Library Path: Y:\MIS_DATABASE\Library\ALTIUM_TOOL\SCHEMATICS_PARTS\MS_DISCRETE_Library.schlib; Footprint Path: Y:\MIS_DATABASE\Library\ALTIUM_TOOL\PCB_FOOTPRINTS\Altium_Footprint_Lib.PcbLib
R468 R473 R480 = RESISTOR_Dup6: RES 0E 1/20W 5% 0201; Mistral Part No: 110010070067-R; Mfr_name: YAGEO AMERICA; Mfr_part_number: RC0201JR-070RL; Part_type: RESISTORS\FIXED; Project: PB_BUGBASE; Voltage: NA; Customs_HS_Code: 85332119; Custom_Duty: 15%; PCB Footprint: RES0201_0-5; Footprint Ref: RES0201_0-5; Tolerance: 5%; Wattage: 1/20W; Package: 0201; Distributor_name: DIGIKEY; Distributor_part_number: 311-0.0NCT-ND; Library Ref: RESISTOR; Height: 0.26MM; Weight: 0.17mg; Temperature: -55°C+125°C; Datasheet: Y:\MIS_DATABASE\DATASHEETS\RESISTORS\RCXXXXL-SER_MAR18.PDF; Crtd /date: MUDDU/120710; Chkd/date: NAVEED/301214; MECHANICAL 3D STEP FILE: RES0201_0-5; Library Path: Y:\MIS_DATABASE\Library\ALTIUM_TOOL\SCHEMATICS_PARTS\MS_DISCRETE_Library.schlib; Footprint Path: Y:\MIS_DATABASE\Library\ALTIUM_TOOL\PCB_FOOTPRINTS\Altium_Footprint_Lib.PcbLib
R470 = RESISTOR_Dup6: RES 10K 1/20W 1% 0201; Mistral Part No: 110011040018-R; Mfr_name: YAGEO AMERICA; Mfr_part_number: RC0201FR-0710KL; Part_type: RESISTORS\FIXED; Project: GOLDEN-I LITE; Voltage: NA; Customs_HS_Code: 85332119; Custom_Duty: 15%; PCB Footprint: RES0201_0-5; Footprint Ref: RES0201_0-5; Tolerance: 1%; Wattage: 1/20W; Package: 0201; Distributor_name: DIGIKEY; Distributor_part_number: 311-10.0KMCT-ND; Library Ref: RESISTOR; Height: 0.26MM; Weight: 0.17mg; Temperature: -55°C+125°C; Datasheet: Y:\MIS_DATABASE\DATASHEETS\RESISTORS\RCXXXXL-SER_MAR18.PDF; Crtd /date: MANIRAJA/270117; Chkd/date: VASANTHA/270117; MECHANICAL 3D STEP FILE: RES0201_0-5; Library Path: Y:\MIS_DATABASE\Library\ALTIUM_TOOL\SCHEMATICS_PARTS\MS_DISCRETE_Library.schlib; Footprint Path: Y:\MIS_DATABASE\Library\ALTIUM_TOOL\PCB_FOOTPRINTS\Altium_Footprint_Lib.PcbLib
R471 R497 = RESISTOR_Dup6: RES 100K 1/10W 1% 0402; Part_type: RESISTORS\FIXED; Mfr_part_number: ERJ-2RKF1003X; Mfr_name: PANASONIC-ECG; Mistral Part No: 110009030187-R; Custom_Duty: 15%; Customs_HS_Code: 85332119; Voltage: NA; Project: J32; PCB Footprint: RES0402_0-5; Footprint Path: Y:\MIS_DATABASE\Library\ALTIUM_TOOL\PCB_FOOTPRINTS\Altium_Footprint_Lib.PcbLib; Library Path: Y:\MIS_DATABASE\Library\ALTIUM_TOOL\SCHEMATICS_PARTS\MS_DISCRETE_Library.schlib; MECHANICAL 3D STEP FILE: RES0402_0-5; Chkd/date: VASANTHA/201216; Crtd /date: MAZHAR/130306; Datasheet: Y:\MIS_DATABASE\DATASHEETS\RESISTORS\PAN-ERJSER_NOV17.PDF; Temperature: -55°C+155°C; Weight: 0.8mg; Height: 0.40MM; Library Ref: RESISTOR; Distributor_part_number: P100KLCT-ND; Distributor_name: DIGIKEY; Package: 0402; Wattage: 1/10W; Tolerance: 1%; Footprint Ref: RES0402_0-5
R483 = RESISTOR_Dup6: RES 0E 1/16W JUMPER 0402; Mistral Part No: 110010080019-R; Mfr_name: VISHAY; Mfr_part_number: CRCW04020000Z0ED; Part_type: RESISTORS\FIXED; Project: PB_BUGBASE; Tolerance: NA; Customs_HS_Code: 85332119; Custom_Duty: 15%; PCB Footprint: RES0402_0-5; Footprint Ref: RES0402_0-5; Voltage: NA; Wattage: 1/16W; Package: 0402; Distributor_name: DIGIKEY; Distributor_part_number: 541-0.0JCT-ND; Library Ref: RESISTOR; Height: 0.40MM; Weight: 0.65mg; Temperature: -55°C+155°C; Datasheet: Y:\MIS_DATABASE\DATASHEETS\RESISTORS\CRCW0603.PDF; Crtd /date: MUDDU/190810; Chkd/date: VASANTHA/201216; MECHANICAL 3D STEP FILE: RES0402_0-5; Library Path: Y:\MIS_DATABASE\Library\ALTIUM_TOOL\SCHEMATICS_PARTS\MS_DISCRETE_Library.schlib; Footprint Path: Y:\MIS_DATABASE\Library\ALTIUM_TOOL\PCB_FOOTPRINTS\Altium_Footprint_Lib.PcbLib
R484 = RESISTOR_Dup4: RES 100K 1/20W 1% 0201; Mistral Part No: 110009060005-R; Mfr_name: YAGEO AMERICA; Mfr_part_number: RC0201FR-07100KL; Part_type: RESISTORS\FIXED; Project: SD865_NANOSOM; Voltage: NA; Customs_HS_Code: 85332119; Custom_Duty: 15%; PCB Footprint: RES0201_0-5; Footprint Path: Y:\MIS_DATABASE\Library\ALTIUM_TOOL\PCB_FOOTPRINTS\Altium_Footprint_Lib.PcbLib; Library Path: Y:\MIS_DATABASE\Library\ALTIUM_TOOL\SCHEMATICS_PARTS\MS_DISCRETE_Library.schlib; Footprint Ref: RES0201_0-5; Library Ref: RESISTOR; MECHANICAL 3D STEP FILE: RES0201_0-5; Tolerance: 1%; Wattage: 1/20W; Package: 0201; Distributor_name: DIGIKEY; Distributor_part_number: 311-100KMCT-ND; Height: 0.26MM; Weight: 9mg; Temperature: -55°C+125°C; Datasheet: Y:\MIS_DATABASE\DATASHEETS\RESISTORS\RCXXXXL-SER_MAR18.PDF; Crtd /date: ALVY/120520; Chkd/date: MANIRAJA/120520
R494 = RESISTOR_Dup6: RES 1K 1/10W 1% 0402; Part_type: RESISTORS\FIXED; Mfr_part_number: ERJ-2RKF1001X; Mfr_name: PANASONIC-ECG; Mistral Part No: 110009030411-R; Custom_Duty: 15%; Customs_HS_Code: 85332119; Voltage: NA; Project: VOCERA; PCB Footprint: RES0402_0-5; Footprint Path: Y:\MIS_DATABASE\Library\ALTIUM_TOOL\PCB_FOOTPRINTS\Altium_Footprint_Lib.PcbLib; Library Path: Y:\MIS_DATABASE\Library\ALTIUM_TOOL\SCHEMATICS_PARTS\MS_DISCRETE_Library.schlib; MECHANICAL 3D STEP FILE: RES0402_0-5; Chkd/date: VASANTHA/281216; Crtd /date: MAZHAR/150506; Datasheet: Y:\MIS_DATABASE\DATASHEETS\RESISTORS\PAN-ERJSER_NOV17.PDF; Temperature: -55°C+155°C; Weight: 0.8mg; Height: 0.40MM; Library Ref: RESISTOR; Distributor_part_number: P1.00KLCT-ND; Distributor_name: DIGIKEY; Package: 0402; Wattage: 1/10W; Tolerance: 1%; Footprint Ref: RES0402_0-5
R495 R502 = RESISTOR_Dup6: RES 10K 1/20W 1% 0201; Part_type: RESISTORS\FIXED; Mfr_part_number: RC0201FR-0710KL; Mfr_name: YAGEO AMERICA; Mistral Part No: 110011040018-R; Custom_Duty: 15%; Customs_HS_Code: 85332119; Voltage: NA; Project: GOLDEN-I LITE; PCB Footprint: RES0201_0-5; Footprint Path: Y:\MIS_DATABASE\Library\ALTIUM_TOOL\PCB_FOOTPRINTS\Altium_Footprint_Lib.PcbLib; Library Path: Y:\MIS_DATABASE\Library\ALTIUM_TOOL\SCHEMATICS_PARTS\MS_DISCRETE_Library.schlib; MECHANICAL 3D STEP FILE: RES0201_0-5; Chkd/date: VASANTHA/270117; Crtd /date: MANIRAJA/270117; Datasheet: Y:\MIS_DATABASE\DATASHEETS\RESISTORS\RCXXXXL-SER_MAR18.PDF; Temperature: -55°C+125°C; Weight: 0.17mg; Height: 0.26MM; Library Ref: RESISTOR; Distributor_part_number: 311-10.0KMCT-ND; Distributor_name: DIGIKEY; Package: 0201; Wattage: 1/20W; Tolerance: 1%; Footprint Ref: RES0201_0-5
R515 = RESISTOR_Dup6: RES 10K 1/20W 1% 0201; Part_type: RESISTORS\FIXED; Mfr_part_number: CRCW020110K0FNED; Mfr_name: VISHAY; Mistral Part No: 110018060032-R; Custom_Duty: 15%; Customs_HS_Code: 85332119; Voltage: NA; Project: NEXTNAV_LPRX_BOARD; PCB Footprint: RES0201_0-5; Footprint Path: Y:\MIS_DATABASE\Library\ALTIUM_TOOL\PCB_FOOTPRINTS\Altium_Footprint_Lib.PcbLib; Library Path: Y:\MIS_DATABASE\Library\ALTIUM_TOOL\SCHEMATICS_PARTS\MS_DISCRETE_Library.schlib; MECHANICAL 3D STEP FILE: RES0201_0-5; Chkd/date: MANIRAJA/260618; Crtd /date: ALVY/260618; Datasheet: Y:\MIS_DATABASE\DATASHEETS\RESISTORS\CRCW0201.PDF; Temperature: -55°C+155°C; Weight: 0.17mg; Height: 0.28MM; Library Ref: RESISTOR; Distributor_part_number: 541-10.0KABCT-ND; Distributor_name: DIGIKEY; Package: 0201; Wattage: 1/20W; Tolerance: 1%; Footprint Ref: RES0201_0-5
TP92 = TESTPOINT: TESTPOINT CIR 20 SMD; Mfr_name: LOCAL; MECHANICAL 3D STEP FILE: NA; Project: BT MODULE_CSRBC04; Footprint Path: Y:\MIS_DATABASE\Library\ALTIUM_TOOL\PCB_FOOTPRINTS\Altium_Footprint_Lib.PcbLib; Library Path: Y:\MIS_DATABASE\Library\ALTIUM_TOOL\SCHEMATICS_PARTS\MS_DISCRETE_Library.schlib; Datasheet: NA; Temperature: NA; Weight: NA; Wattage: NA; Voltage: NA; Tolerance: NA; Chkd/date: SHREESHAIL/171006; Crtd /date: MAZHAR/171006; Height: NA; Distributor_part_number: NA; Distributor_name: NA; Package: SMD; Part_type: TESTPOINT; Mfr_part_number: TP20_SMD; Mistral Part No: NA; Library Ref: TESTPOINT; Footprint Ref: TP20_SMD; RoHS: NA; Customs_HS_Code: NA; Custom_Duty: NA; PCB Footprint: TP20_SMD
U39 = W25Q80BWSNIG_SOIC8: IC SERIAL FLASH MEMORY SOIC8; Mistral Part No: 141117020010-R; Mfr_name: WINBOND; Mfr_part_number: W25Q80DVSNIG-TR; Part_type: ICS\DIGITAL\MEMORY; Project: SD820_NANO_SOM; Tolerance: NA; Customs_HS_Code: 85423100; Custom_Duty: 15%; PCB Footprint: SOIC8_1-8; Voltage: NA; Wattage: NA; Package: SOIC8; Distributor_name: DIGIKEY; Distributor_part_number: W25Q80DVSNIG CT-ND; Library Ref: W25Q80BWSNIG_SOIC8; Height: 1.75MM; Weight: NA; Temperature: -40°C+85°C; Datasheet: Y:\MIS_DATABASE\DATASHEETS\ICS\MEMORY\W25Q80DVSS.PDF; Crtd /date: MANIRAJA/150217; Chkd/date: VASANTHA/150217; MECHANICAL 3D STEP FILE: SOIC8_1-8
U68 = TPS65988DJ_VQFN56: IC 2-PORT USB TYPE-C AND USB PD CONTROLLER WITH INTEGRATED POWER SWITCH VQFN56; Part_type: ICS\POWER\MANAGEMENT; Mfr_name: TEXAS INSTRUMENTS; Mistral Part No: 142021070017-R; Custom_Duty: 15%; Customs_HS_Code: 85423100; Wattage: NA; Project: TI_AM62x_SKEVM; PCB Footprint: VQFN56_TPS65987D_280X280_1; Footprint Path: Y:\MIS_DATABASE\Library\ALTIUM_TOOL\PCB_FOOTPRINTS\Altium_Footprint_Lib.PcbLib; Library Path: Y:\MIS_DATABASE\Library\ALTIUM_TOOL\SCHEMATICS_PARTS\MS_MISCPOWER_Library.schlib; MECHANICAL 3D STEP FILE: VQFN56_TPS65987D_280X280_1; Chkd/date: MANIRAJA/290721; Crtd /date: ALVY/280721; Datasheet: Y:\MIS_DATABASE\DATASHEETS\ICS\POWER\TPS65988DHRSHR.PDF; Temperature: -10°C+75°C; Weight: 127.6mg; Height: 1.00MM; Library Ref: TPS65988DJ_VQFN56; Distributor_part_number: 296-52068-1-ND; Distributor_name: DIGIKEY; Package: VQFN56; Voltage: NA; Tolerance: NA; Mfr_part_number: TPS65988DHRSHR; Footprint Ref: VQFN56_TPS65987D_280X280_1
U69 = TVS2200_WSON6: IC 22V FLAT-CLAMP SURGE PROTECTION DEVICE WSON6; Part_type: ICS\POWER; Mfr_name: TEXAS INSTRUMENTS; Mistral Part No: 142021100001-R; Custom_Duty: 15%; Customs_HS_Code: 85423100; Wattage: NA; Project: TI_AM62x SKEVM_BRD; PCB Footprint: SON6_25-59_85X85_0-8; Footprint Path: Y:\MIS_DATABASE\Library\ALTIUM_TOOL\PCB_FOOTPRINTS\Altium_Footprint_Lib.PcbLib; Library Path: Y:\MIS_DATABASE\Library\ALTIUM_TOOL\SCHEMATICS_PARTS\MS_MISCPOWER_Library.schlib; MECHANICAL 3D STEP FILE: SON6_25-59_85X85_0-8; Chkd/date: MANIRAJA/011021; Crtd /date: ALVY/011021; Datasheet: Y:\MIS_DATABASE\DATASHEETS\ICS\POWER\TVS2200.PDF; Temperature: -40°C+125°C; Weight: 12mg; Height: 0.80MM; Footprint Ref: SON6_25-59_85X85_0-8; Library Ref: TVS2200_WSON6; Distributor_part_number: 296-52187-1-ND; Distributor_name: DIGIKEY; Package: WSON6; Voltage: NA; Tolerance: NA; Mfr_part_number: TVS2200DRVR